# Altium project CSYEI_LayoutExercice2018.PrjPcb
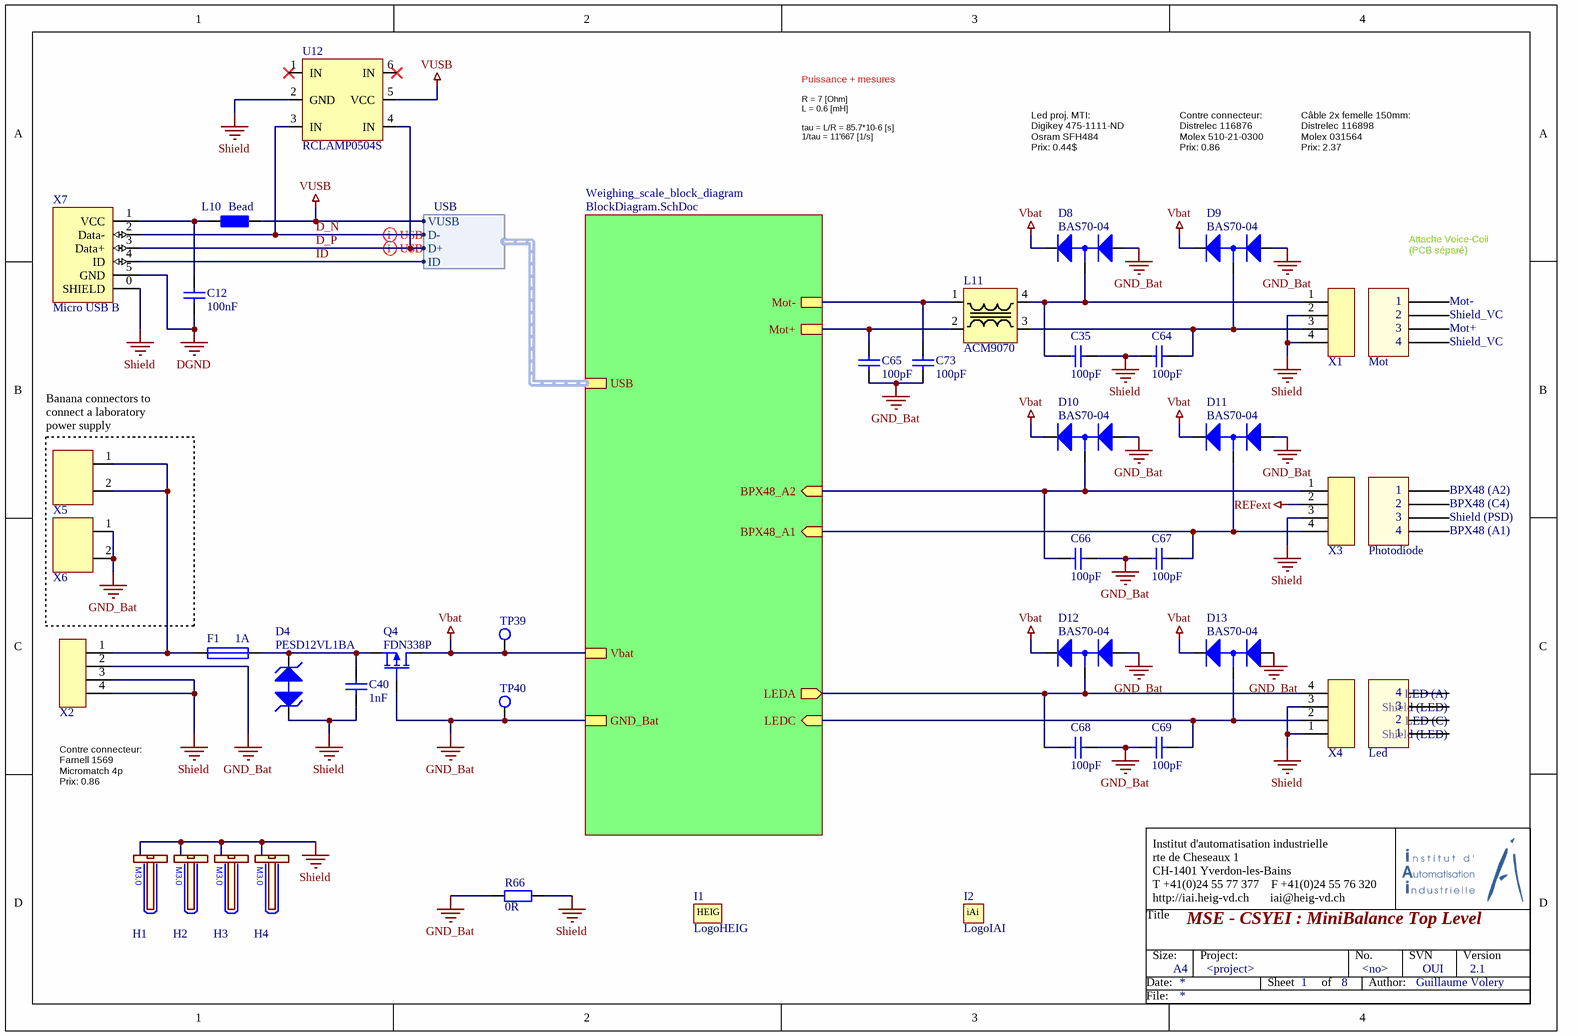
[diagram p0: TopLevel.SchDoc]
8 sheets, 227 parts. Net scope: hierarchical (ports join the sheet entries above them; power ports are global).
Board file: PCB.PcbDoc
Sheets:
  TopLevel.SchDoc
    Weighing_scale_block_diagram = BlockDiagram.SchDoc
      Weighing_scale_controller = Controller.SchDoc
      Weighing_scale_display = Display.SchDoc
      Weighing_scale_power_supply = PowerSupply.SchDoc
      Weighing_scale_position_measurement = PositionMeasurement.SchDoc
      Weighing_scale_current_voltage_measurement = CurrentVoltageMeasurement.SchDoc
      Weighing_scale_capacitive_touch = CapacitiveTouch.SchDoc

## Sheet TopLevel.SchDoc: MSE - CSYEI : MiniBalance Top Level
size A4; Author: Guillaume Volery; SheetNumber: 1; SheetTotal: 8; SVN: OUI; Version: 2.1; NoProject: <no>; TitleProject: <project>; PageSetup: Record=PageOptions|CenterHorizontal=True|CenterVertical=True|PrintScale=0.97|XCorrection=1.00|YCorrection=1.00|PrintKind=0|BorderSize=5000000|LeftOffset=0|BottomOffset=0|Orientation=2|PaperLength=1000|PaperWidth=1000|Scale=100|PaperSource=7|PrintQuality=-3|MediaType=1|DitherType=10|PrintScaleMode=1|PaperKind=A4 (210 x 297 mm)|PaperIndex=9

### Parts
C12  100nF  [CAPC2012N]
C35  100pF  [CAPC2012N]
C40  1nF  [CAPC2012N]
C64  100pF  [CAPC2012N]
C65  100pF  [CAPC2012N]
C66  100pF  [CAPC2012N]
C67  100pF  [CAPC2012N]
C68  100pF  [CAPC2012N]
C69  100pF  [CAPC2012N]
C73  100pF  [CAPC2012N]
D4  PESD12VL1BA  [SOD323]
D8  BAS70-04  [SOT23-3N]
D9  BAS70-04  [SOT23-3N]
D10  BAS70-04  [SOT23-3N]
D11  BAS70-04  [SOT23-3N]
D12  BAS70-04  [SOT23-3N]
D13  BAS70-04  [SOT23-3N]
F1  1A  [RESC2012N]
H1  Mhole M3  [MHOLE_M3.0]  (value not drawn)
H2  Mhole M3  [MHOLE_M3.0]  (value not drawn)
H3  Mhole M3  [MHOLE_M3.0]  (value not drawn)
H4  Mhole M3  [MHOLE_M3.0]  (value not drawn)
I1  LogoHEIG  [LOGO HEIG-VD_TOP/solder TOP]
I2  LogoIAI  [LOGO_IAI_TOP]
L10  Bead  [RESC2012N]
L11  ACM9070  [ACM9070]
Q4  FDN338P  [SOT23-3N]
R66  0R  [RESC2012N]
TP39  TP  [Testpoint]  (value not drawn)
TP40  TP  [Testpoint]  (value not drawn)
U12  RCLAMP0504S  [SOT-23-6]
X1  MicroMatch4p  [MicroMatch4p]  (value not drawn)
X2  MicroMatch4p  [MicroMatch4p]  (value not drawn)
X3  MicroMatch4p  [MicroMatch4p]  (value not drawn)
X4  MicroMatch4p  [MicroMatch4p]  (value not drawn)
X5  Fiche Banane Rouge 4mm  [BANANE]  (value not drawn)
X6  Fiche Banane Noire 4mm  [BANANE]  (value not drawn)
X7  Micro USB B  [Micro_USB_ZX62-B-5PA(33)]

### Sub-sheets
Weighing_scale_block_diagram = BlockDiagram.SchDoc: LEDA (out), LEDC (in), BPX48_A2 (in), BPX48_A1 (in), Mot-, Mot+, Vbat, GND_Bat, USB (harness USB)

### Harnesses
USB: VUSB, D-, D+, ID

### Nets
DGND: C12.1 X7.5(GND)
GND: C69.2 D13.3(A/K) X4.2 ; sheet Weighing_scale_block_diagram/LEDC
GND_Bat: C65.1 C66.2 C67.1 C68.2 C69.1 C73.1 D8.1(A) D9.1(A) D10.1(A) D11.1(A) D12.1(A) D13.1(A) Q4.1(G) R66.1 TP40.1 X2.2 X6.1 X6.2 ; sheet Weighing_scale_block_diagram/GND_Bat
REFext: X3.2
Shield: C35.2 C40.1 C64.1 D4.1(K1) H1.1(S) H2.1(S) H3.1(S) H4.1(S) R66.2 U12.2(GND) X1.2 X1.4 X2.3 X2.4 X3.3 X4.1 X4.3 X7.0(SHIELD)
Vbat: D8.2(K) D9.2(K) D10.2(K) D11.2(K) D12.2(K) D13.2(K) Q4.3(D) TP39.1 ; sheet Weighing_scale_block_diagram/Vbat
VUSB: L10.2 U12.5(VCC) ; sheet Weighing_scale_block_diagram/USB.VUSB
D_N: U12.3(IN) X7.2(Data-) ; sheet Weighing_scale_block_diagram/USB.D-
D_P: U12.4(IN) X7.3(Data+) ; sheet Weighing_scale_block_diagram/USB.D+
ID: X7.4(ID) ; sheet Weighing_scale_block_diagram/USB.ID
Net1_1: C66.1 D10.3(A/K) X3.1 ; sheet Weighing_scale_block_diagram/BPX48_A2
NetC12_2: C12.2 L10.1 X7.1(VCC)
NetC35_1: C35.1 D8.3(A/K) L11.4 X1.1
NetC40_2: C40.2 D4.2(K2) F1.2 Q4.2(S)
NetC64_2: C64.2 D9.3(A/K) L11.3 X1.3
NetC65_2: C65.2 L11.2 ; sheet Weighing_scale_block_diagram/Mot+
NetC67_2: C67.2 D11.3(A/K) X3.4 ; sheet Weighing_scale_block_diagram/BPX48_A1
NetC68_1: C68.1 D12.3(A/K) X4.4 ; sheet Weighing_scale_block_diagram/LEDA
NetC72_1: C73.2 L11.1 ; sheet Weighing_scale_block_diagram/Mot-
NetF1_1: F1.1 X2.1 X5.1 X5.2

Not connected (* = marked no-connect by the designer): U12 1(IN)* 6(IN)*

### Layout directives
differential pair: D_N, D_P

### Notes on the sheet
- Puissance + mesures
- Led proj. MTI:
  Digikey 475-1111-ND
  Osram SFH484
  Prix: 0.44$
- R = 7 [Ohm]
  L = 0.6 [mH]
  tau = L/R = 85.7*10-6 [s]
  1/tau = 11'667 [1/s]
- Contre connecteur:
  Distrelec 116876
  Molex 510-21-0300
  Prix: 0.86
- Câble 2x femelle 150mm:
  Distrelec 116898
  Molex 031564
  Prix: 2.37
- 1
- Attache Voice-Coil
  (PCB séparé)
- Mot-
- (near X1) Mot
- 2
- 3
- 4
- Shield_VC
- Mot+
- (near X5) Banana connectors to connect a laboratory power supply
- BPX48 (A2)
- BPX48 (C4)
- Shield (PSD)
- (near X3) Photodiode
- BPX48 (A1)
- LED (C)
- Shield (LED)
- LED (A)
- (near X4) Led
- Contre connecteur:
  Farnell 1569
  Micromatch 4p
  Prix: 0.86
- Title
- Institut d'automatisation industrielle
  rte de Cheseaux 1
  CH-1401 Yverdon-les-Bains
  T +41(0)24 55 77 377    F +41(0)24 55 76 320
  http://iai.heig-vd.ch       iai@heig-vd.ch
- Date:
- Size:
- A4
- Project:
- Sheet
- of
- No.
- Author:
- SVN
- Version
- File:
- (in symbol LogoHEIG) HEIG
- (in symbol LogoIAI) iAi
- (in symbol M3) M3.0

### Library data of the parts
C12 = Cap_100nF: Capacitor; Value: 100nF; Supplier 1: Digi-Key; Supplier Part Number 1: 478-1395-1-ND
C35 C64-C69 C73 = Cap_100pF: Capacitor; Value: 100pF; Supplier 1: Digi-Key; Supplier Part Number 1: 399-1122-1-ND
C40 = Cap_1nF: Capacitor; Value: 1nF; Supplier 1: Digi-Key; Supplier Part Number 1: 311-1127-1-ND
F1 = Fuse_1A: MFU0805FF01000P100; Supplier 1: Digi-Key; Supplier Part Number 1: MFU08051.00CT-ND; Value: 1A
H1-H4 = M3: Value: Mhole M3
Q4 = FDN338P: MOSFet P; Supplier 1: Digi-Key; Supplier Part Number 1: FDN338PCT-ND; Value: FDN338P
R66 = Res_0R: Resistor; Value: 0R; Supplier 1: Digi-Key; Supplier Part Number 1: 311-0.0ARCT-ND
TP39 TP40 = TP: =Value; Supplier 1: Digi-Key; Supplier Part Number 1: 36-5006-ND
U12 = RCLAMP0504S.TCT: Supplier 1: Digi-Key; Supplier Part Number 1: RCLAMP0504SCT-ND
X7 = Micro_USB_ZX62-B-5PA(33): Supplier 1: Digi-Key; Supplier Part Number 1: H125270CT-ND
D4 = PESD12VL1BA: Supplier 1: Digi-Key; Supplier Part Number 1: 568-4022-1-ND
D8-D13 = BAS70-04: Supplier 1: Digi-Key; Supplier Part Number 1: BAS70-04-FDICT-ND
L10 = Bead: Value: Bead; Supplier 1: Digi-Key; Supplier Part Number 1: 240-2399-1-ND
L11 = ACM9070: Supplier 1: Digi-Key; Supplier Part Number 1: 445-2216-1-ND
X1-X4 = MicroMatch4p: Supplier 1: Digi-Key; Supplier Part Number 1: A107022CT-ND
X5 = Fiche Banane Rouge 4mm: Supplier 1: Farnell; Supplier Part Number 1: 1698982
X6 = Fiche Banane Noire 4mm: Supplier 1: Farnell; Supplier Part Number 1: 1698983

## Sheet BlockDiagram.SchDoc: MSE - CSYEI : Block diagram
size A4; Author: Guillaume Volery; SheetNumber: 2; SheetTotal: 8; SVN: OUI; Version: 2.1; NoProject: <no>; TitleProject: <project>
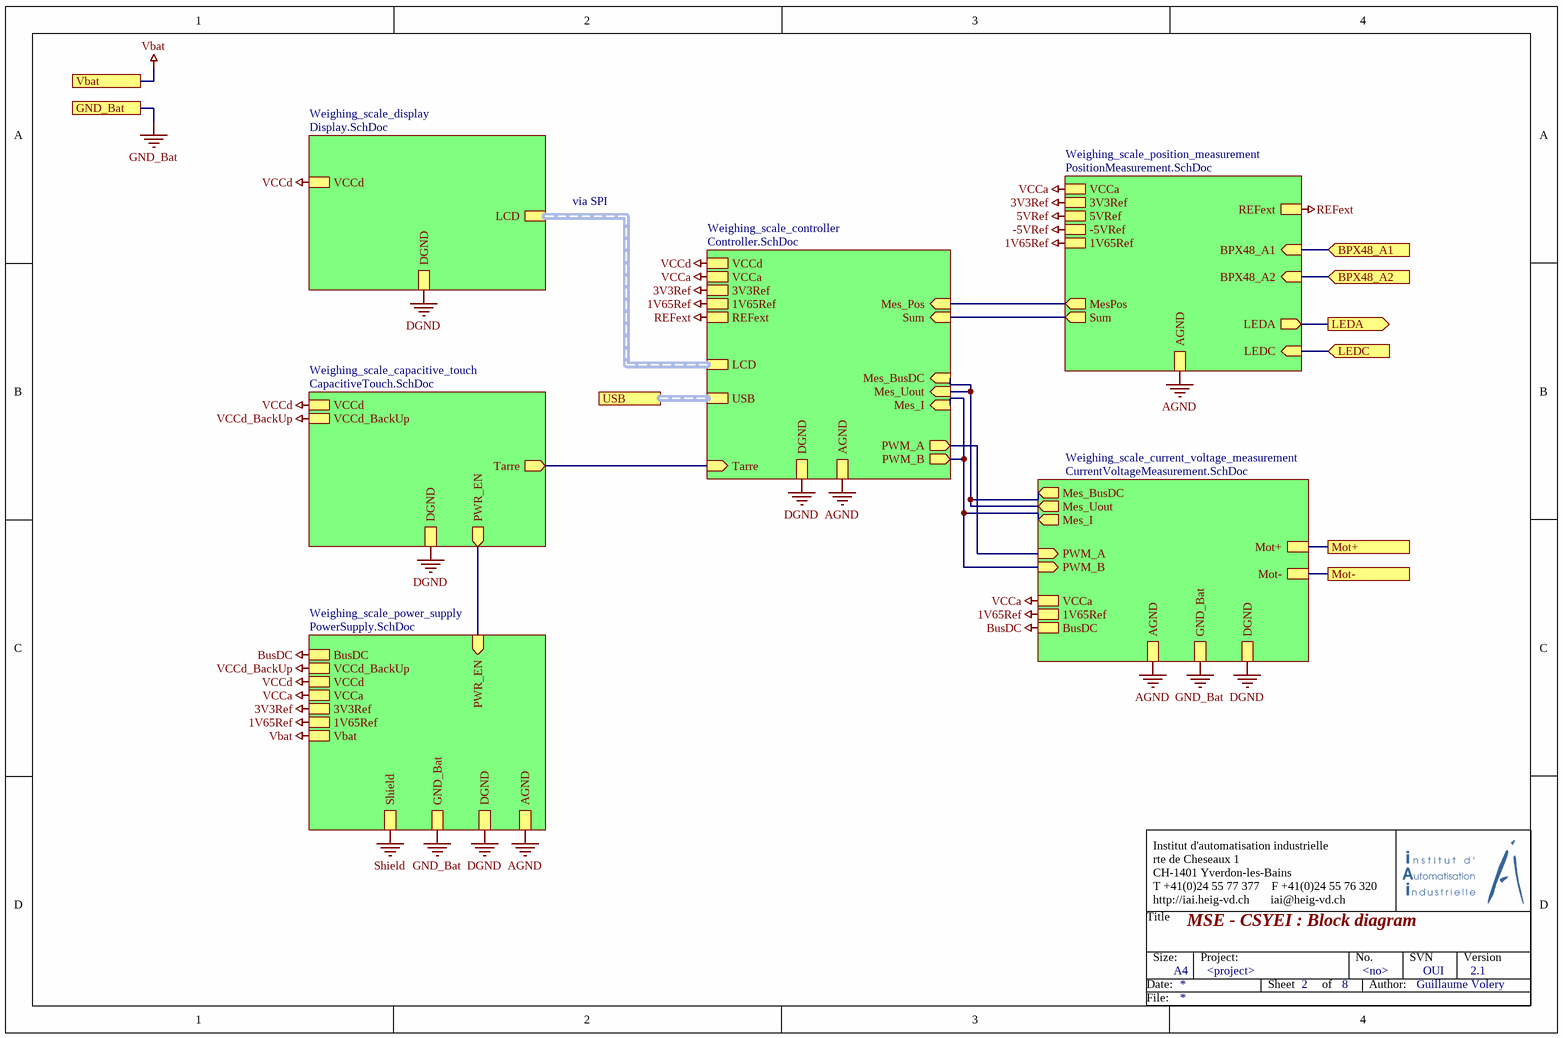
[diagram p1: BlockDiagram.SchDoc]

### Sub-sheets
Weighing_scale_capacitive_touch = CapacitiveTouch.SchDoc: Tarre (out), DGND, PWR_EN (out), VCCd, VCCd_BackUp
Weighing_scale_controller = Controller.SchDoc: VCCd, AGND, Mes_I (in), 3V3Ref, PWM_A (out), Sum (in), PWM_B (out), Mes_Pos (in), DGND, 1V65Ref, Mes_Uout (in), Tarre (in), Mes_BusDC (in), VCCa, LCD (harness LCD), USB (harness USB), REFext
Weighing_scale_current_voltage_measurement = CurrentVoltageMeasurement.SchDoc: Mot+, Mot-, Mes_BusDC (out), Mes_Uout (out), AGND, VCCa, PWM_B (in), GND_Bat, Mes_I (out), DGND, 1V65Ref, BusDC, PWM_A (in)
Weighing_scale_display = Display.SchDoc: VCCd, DGND, LCD (harness LCD)
Weighing_scale_position_measurement = PositionMeasurement.SchDoc: VCCa, MesPos (out), LEDA (out), 3V3Ref, Sum (out), LEDC (in), AGND, REFext, BPX48_A1 (in), BPX48_A2 (in), 5VRef, -5VRef, 1V65Ref
Weighing_scale_power_supply = PowerSupply.SchDoc: Vbat, GND_Bat, AGND, VCCd, BusDC, VCCa, Shield, DGND, PWR_EN (in), VCCd_BackUp, 3V3Ref, 1V65Ref

### Ports
BPX48_A1 (in), BPX48_A2 (in), GND_Bat, LEDA (out), LEDC (in), Mot+, Mot-, USB (harness USB), Vbat

### Nets
1V65Ref: sheet Weighing_scale_controller/1V65Ref, sheet Weighing_scale_power_supply/1V65Ref, sheet Weighing_scale_position_measurement/1V65Ref, sheet Weighing_scale_current_voltage_measurement/1V65Ref
3V3Ref: sheet Weighing_scale_controller/3V3Ref, sheet Weighing_scale_power_supply/3V3Ref, sheet Weighing_scale_position_measurement/3V3Ref
-5VRef: sheet Weighing_scale_position_measurement/-5VRef
AGND: sheet Weighing_scale_controller/AGND, sheet Weighing_scale_power_supply/AGND, sheet Weighing_scale_position_measurement/AGND, sheet Weighing_scale_current_voltage_measurement/AGND
BusDC: sheet Weighing_scale_power_supply/BusDC, sheet Weighing_scale_current_voltage_measurement/BusDC
DGND: sheet Weighing_scale_controller/DGND, sheet Weighing_scale_display/DGND, sheet Weighing_scale_power_supply/DGND, sheet Weighing_scale_current_voltage_measurement/DGND, sheet Weighing_scale_capacitive_touch/DGND
GND: port LEDC, sheet Weighing_scale_position_measurement/LEDC
GND_Bat: port GND_Bat, sheet Weighing_scale_power_supply/GND_Bat, sheet Weighing_scale_current_voltage_measurement/GND_Bat
REFext: sheet Weighing_scale_controller/REFext, sheet Weighing_scale_position_measurement/REFext
Vbat: port Vbat, sheet Weighing_scale_power_supply/Vbat
VCCa: sheet Weighing_scale_controller/VCCa, sheet Weighing_scale_power_supply/VCCa, sheet Weighing_scale_position_measurement/VCCa, sheet Weighing_scale_current_voltage_measurement/VCCa
VCCd: sheet Weighing_scale_controller/VCCd, sheet Weighing_scale_display/VCCd, sheet Weighing_scale_power_supply/VCCd, sheet Weighing_scale_capacitive_touch/VCCd
VCCd_BackUp: sheet Weighing_scale_power_supply/VCCd_BackUp, sheet Weighing_scale_capacitive_touch/VCCd_BackUp
PWM_A: sheet Weighing_scale_controller/PWM_A, sheet Weighing_scale_current_voltage_measurement/PWM_A
PWM_B: sheet Weighing_scale_controller/Mes_I, sheet Weighing_scale_controller/PWM_B, sheet Weighing_scale_current_voltage_measurement/PWM_B, sheet Weighing_scale_current_voltage_measurement/Mes_I
PWR_EN: sheet Weighing_scale_power_supply/PWR_EN, sheet Weighing_scale_capacitive_touch/PWR_EN
Tarre: sheet Weighing_scale_controller/Tarre, sheet Weighing_scale_capacitive_touch/Tarre
Net1_1: port BPX48_A2, sheet Weighing_scale_position_measurement/BPX48_A2
NetC15_1: sheet Weighing_scale_controller/Mes_Uout, sheet Weighing_scale_controller/Mes_BusDC, sheet Weighing_scale_current_voltage_measurement/Mes_BusDC, sheet Weighing_scale_current_voltage_measurement/Mes_Uout
NetC65_2: port Mot+, sheet Weighing_scale_current_voltage_measurement/Mot+
NetC67_2: port BPX48_A1, sheet Weighing_scale_position_measurement/BPX48_A1
NetC68_1: port LEDA, sheet Weighing_scale_position_measurement/LEDA
NetC72_1: port Mot-, sheet Weighing_scale_current_voltage_measurement/Mot-
NetIC_OPAMP_GP_1_CIRCUIT_8DII#2_OUTPUT: sheet Weighing_scale_controller/Mes_Pos, sheet Weighing_scale_position_measurement/MesPos
NetIC_OPAMP_GP_1_CIRCUIT_8DII#4_OUTPUT: sheet Weighing_scale_controller/Sum, sheet Weighing_scale_position_measurement/Sum

### Buses and harness runs
harness port USB = sheet Weighing_scale_controller/USB
harness sheet Weighing_scale_controller/LCD = sheet Weighing_scale_display/LCD

### Notes on the sheet
- via SPI
- Title
- Institut d'automatisation industrielle
  rte de Cheseaux 1
  CH-1401 Yverdon-les-Bains
  T +41(0)24 55 77 377    F +41(0)24 55 76 320
  http://iai.heig-vd.ch       iai@heig-vd.ch
- Date:
- Size:
- A4
- Project:
- Sheet
- of
- No.
- Author:
- SVN
- Version
- File:

## Sheet Controller.SchDoc: MSE - CSYEI : DSPic controller
size A3; Author: Guillaume Volery; SheetNumber: 4; SheetTotal: 8; SVN: OUI; Version: 2.1; NoProject: <no>; TitleProject: <project>; PageSetup: Record=PageOptions|CenterHorizontal=True|CenterVertical=True|PrintScale=1.00|XCorrection=1.00|YCorrection=1.00|PrintKind=0|BorderSize=5000000|LeftOffset=0|BottomOffset=0|Orientation=2|PaperLength=1000|PaperWidth=1000|Scale=100|PaperSource=7|PrintQuality=-3|MediaType=1|DitherType=10|PrintScaleMode=1|PaperKind=A4 (210 x 297 mm)|PaperIndex=9
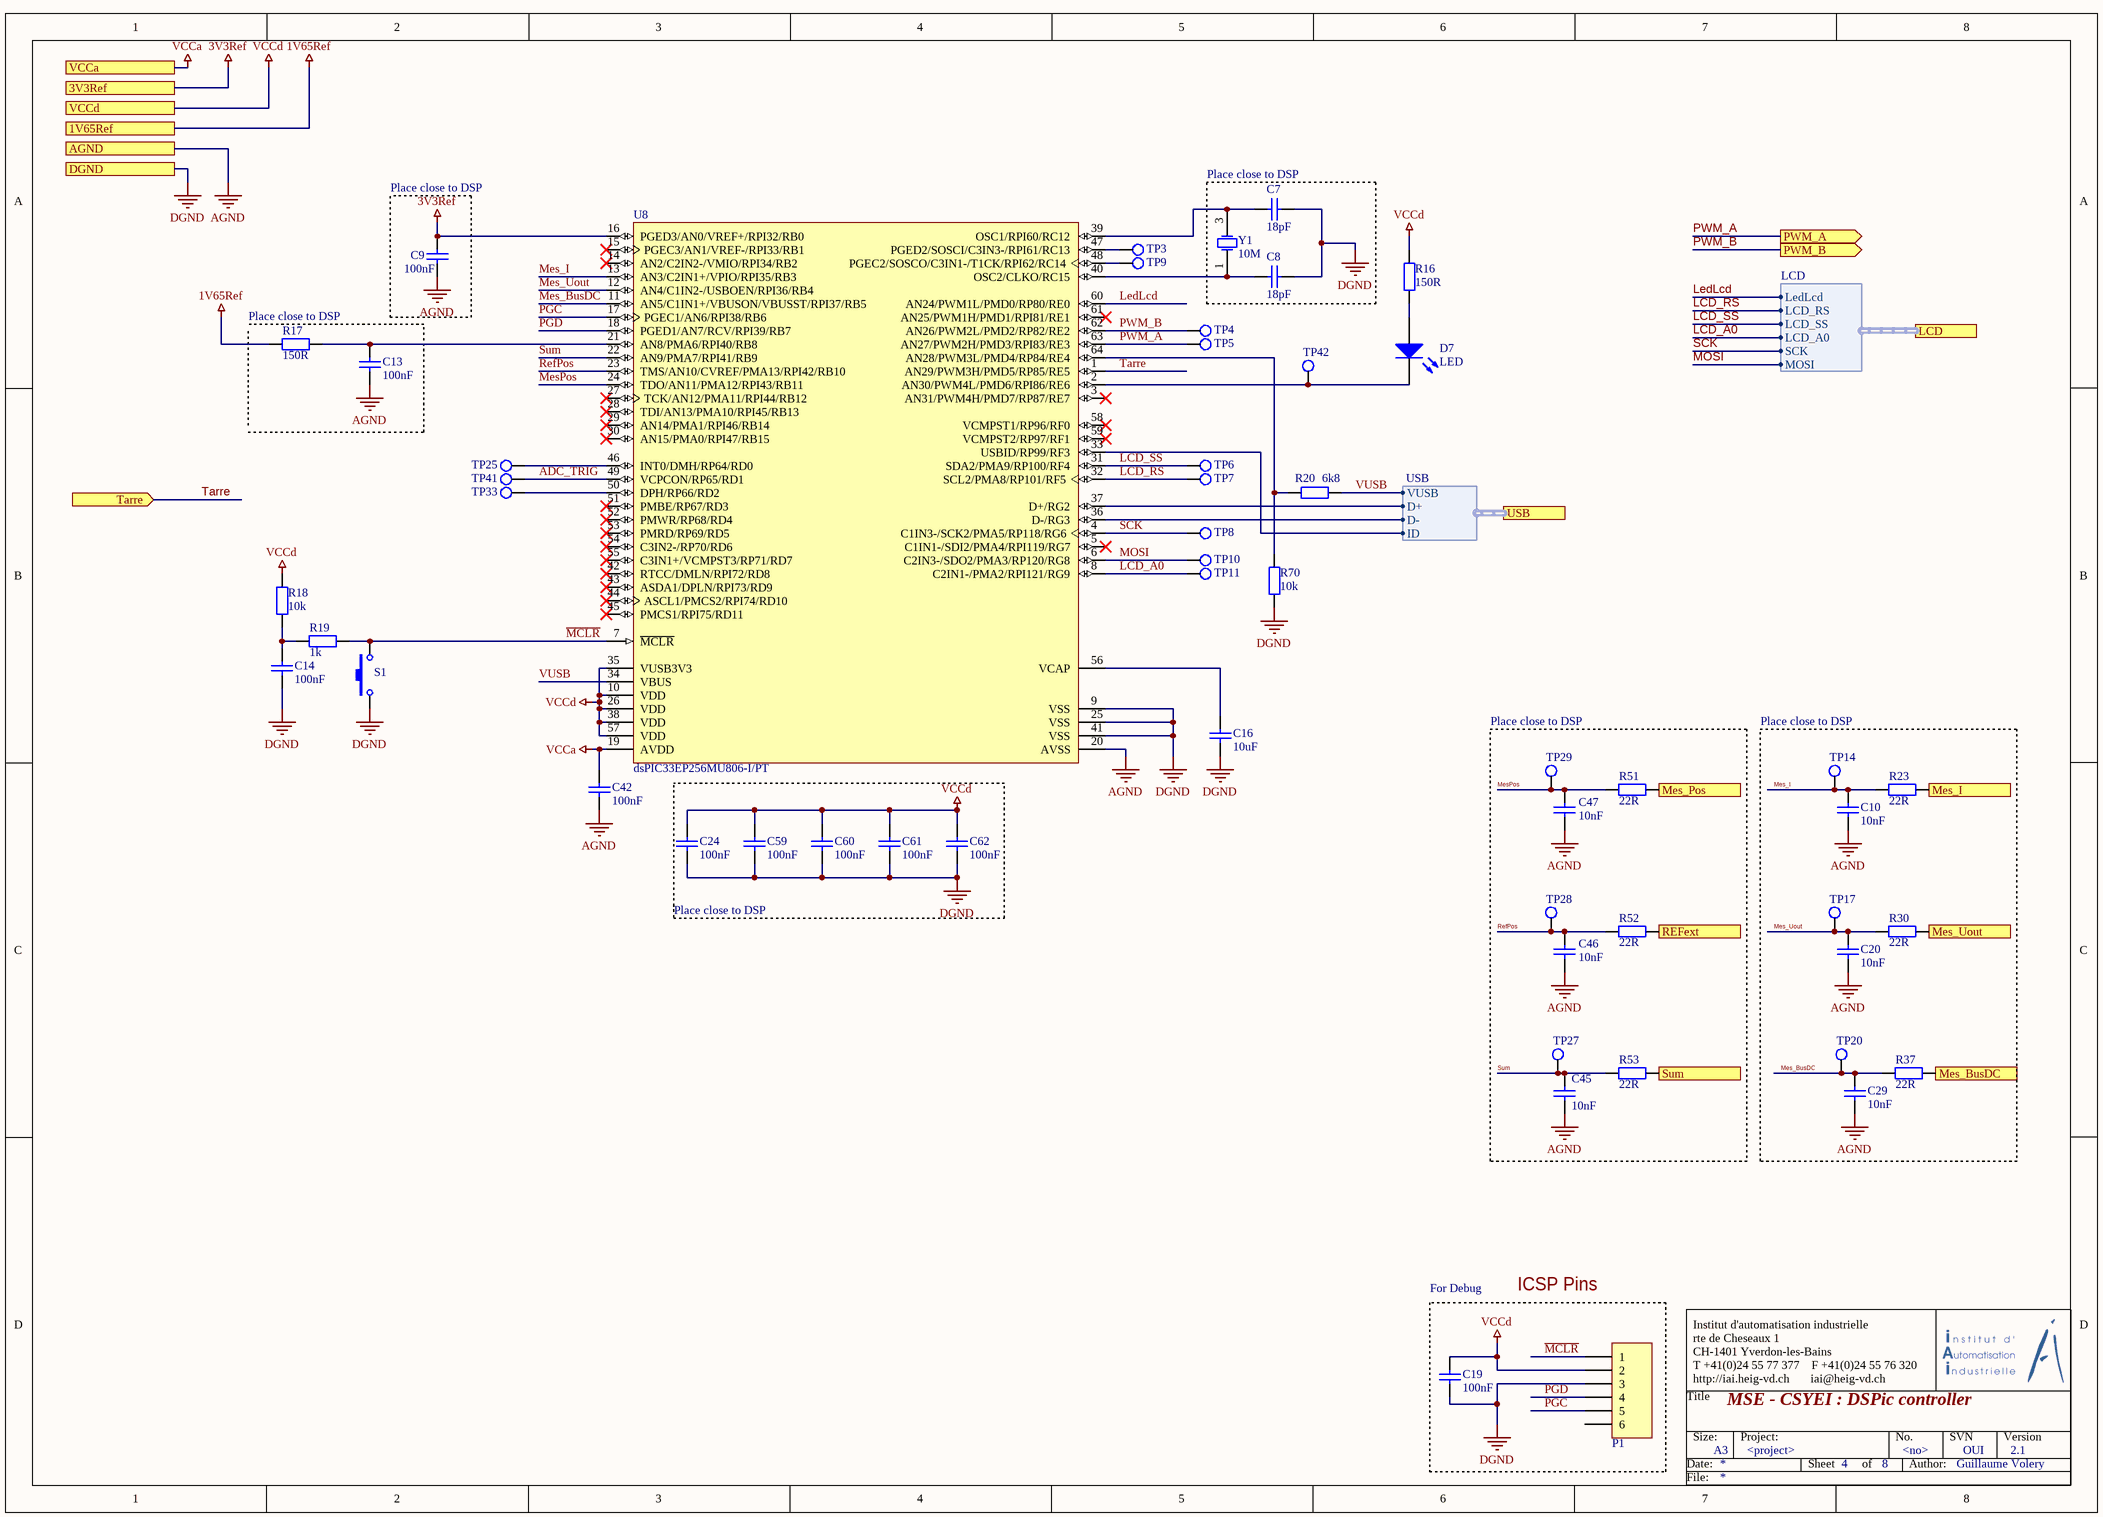
[diagram p2: Controller.SchDoc]

### Parts
C7  18pF  [CAPC2012N]
C8  18pF  [CAPC2012N]
C9  100nF  [CAPC2012N]
C10  10nF  [CAPC2012N]
C13  100nF  [CAPC2012N]
C14  100nF  [CAPC2012N]
C16  10uF  [CAP1206]
C19  100nF  [CAPC2012N]
C20  10nF  [CAPC2012N]
C24  100nF  [CAPC2012N]
C29  10nF  [CAPC2012N]
C42  100nF  [CAPC2012N]
C45  10nF  [CAPC2012N]
C46  10nF  [CAPC2012N]
C47  10nF  [CAPC2012N]
C59  100nF  [CAPC2012N]
C60  100nF  [CAPC2012N]
C61  100nF  [CAPC2012N]
C62  100nF  [CAPC2012N]
D7  LED  [LED2012N]
P1  Connector  [HEADER_6]  (value not drawn)
R16  150R  [RESC2012N]
R17  150R  [RESC2012N]
R18  10k  [RESC2012N]
R19  1k  [RESC2012N]
R20  6k8  [RESC2012N]
R23  22R  [RESC2012N]
R30  22R  [RESC2012N]
R37  22R  [RESC2012N]
R51  22R  [RESC2012N]
R52  22R  [RESC2012N]
R53  22R  [RESC2012N]
R70  10k  [RESC2012N]
S1  SW PTS810  [SW PTS810]  (value not drawn)
TP3  TP  [Testpoint]  (value not drawn)
TP4  TP  [Testpoint]  (value not drawn)
TP5  TP  [Testpoint]  (value not drawn)
TP6  TP  [Testpoint]  (value not drawn)
TP7  TP  [Testpoint]  (value not drawn)
TP8  TP  [Testpoint]  (value not drawn)
TP9  TP  [Testpoint]  (value not drawn)
TP10  TP  [Testpoint]  (value not drawn)
TP11  TP  [Testpoint]  (value not drawn)
TP14  TP  [Testpoint]  (value not drawn)
TP17  TP  [Testpoint]  (value not drawn)
TP20  TP  [Testpoint]  (value not drawn)
TP25  TP  [Testpoint]  (value not drawn)
TP27  TP  [Testpoint]  (value not drawn)
TP28  TP  [Testpoint]  (value not drawn)
TP29  TP  [Testpoint]  (value not drawn)
TP33  TP  [Testpoint]  (value not drawn)
TP41  TP  [Testpoint]  (value not drawn)
TP42  TP  [Testpoint]  (value not drawn)
U8  dsPIC33EP256MU806-I/PT  [TQFP64]
Y1  value 10M  [CRYSTAL_ABMM]  (hidden comment: XTAL)

### Blocks framed on the sheet
Place close to DSP: C7 C8 Y1
Place close to DSP: C9
Place close to DSP: C45-C47 R51-R53 TP27-TP29
Place close to DSP: C10 C20 C29 R23 R30 R37 TP14 TP17 TP20
ICSP Pins: C19 P1

### Ports
1V65Ref, 3V3Ref, AGND, DGND, LCD (harness LCD), Mes_BusDC (in), Mes_I (in), Mes_Pos (in), Mes_Uout (in), PWM_A (out), PWM_B (out), REFext, Sum (in), Tarre (in), USB (harness USB), VCCa, VCCd

### Harnesses
LCD: LCD_RS, LCD_SS, MOSI, SCK, LedLcd, LCD_A0
USB: VUSB, D-, D+, ID

### Nets
1V65Ref: R17.1 ; port 1V65Ref
3V3Ref: C9.2 U8.16(PGED3/AN0/VREF+/RPI32/RB0) ; port 3V3Ref
AGND: C9.1 C10.1 C13.1 C20.1 C29.1 C42.1 C45.1 C46.1 C47.1 U8.20(AVSS) ; port AGND
DGND: C7.2 C8.2 C14.1 C16.1 C19.1 C24.1 C59.1 C60.1 C61.1 C62.1 P1.3 R70.1 S1.1 U8.9(VSS) U8.25(VSS) U8.41(VSS) ; port DGND
REFext: R52.2 ; port REFext
VCCa: C42.2 U8.19(AVDD) ; port VCCa
VCCd: C19.2 C24.2 C59.2 C60.2 C61.2 C62.2 P1.2 R16.2 R18.2 U8.10(VDD) U8.26(VDD) U8.35(VUSB3V3) U8.38(VDD) U8.57(VDD) ; port VCCd
VUSB: R20.2 U8.34(VBUS) ; port USB.VUSB
~{MCLR}: P1.1 R19.2 S1.3 U8.7(~{MCLR})
ADC_TRIG: TP41.1 U8.49(VCPCON/RP65/RD1)
D_N: U8.36(D-/RG3) ; port USB.D-
D_P: U8.37(D+/RG2) ; port USB.D+
ID: U8.33(USBID/RP99/RF3) ; port USB.ID
LCD_A0: TP11.1 U8.8(C2IN1-/PMA2/RPI121/RG9) ; port LCD.LCD_A0
LCD_RS: TP7.1 U8.32(SCL2/PMA8/RP101/RF5) ; port LCD.LCD_RS
LCD_SS: TP6.1 U8.31(SDA2/PMA9/RP100/RF4) ; port LCD.LCD_SS
LedLcd: U8.60(AN24/PWM1L/PMD0/RP80/RE0) ; port LCD.LedLcd
Mes_BusDC: C29.2 R37.1 TP20.1 U8.11(AN5/C1IN1+/VBUSON/VBUSST/RPI37/RB5)
Mes_I: C10.2 R23.1 TP14.1 U8.13(AN3/C2IN1+/VPIO/RPI35/RB3)
Mes_Uout: C20.2 R30.1 TP17.1 U8.12(AN4/C1IN2-/USBOEN/RPI36/RB4)
MesPos: C47.2 R51.1 TP29.1 U8.24(TDO/AN11/PMA12/RPI43/RB11)
MOSI: TP10.1 U8.6(C2IN3-/SDO2/PMA3/RP120/RG8) ; port LCD.MOSI
PGC: P1.5 U8.17(PGEC1/AN6/RPI38/RB6)
PGD: P1.4 U8.18(PGED1/AN7/RCV/RPI39/RB7)
PWM_A: TP5.1 U8.63(AN27/PWM2H/PMD3/RPI83/RE3) ; port PWM_A
PWM_B: R23.2 TP4.1 U8.62(AN26/PWM2L/PMD2/RP82/RE2) ; port PWM_B, port Mes_I
RefPos: C46.2 R52.1 TP28.1 U8.23(TMS/AN10/CVREF/PMA13/RPI42/RB10)
SCK: TP8.1 U8.4(C1IN3-/SCK2/PMA5/RP118/RG6) ; port LCD.SCK
Sum: C45.2 R53.1 TP27.1 U8.22(AN9/PMA7/RPI41/RB9)
Tarre: U8.1(AN29/PWM3H/PMD5/RP85/RE5) ; port Tarre
NetC7_1: C7.1 U8.39(OSC1/RPI60/RC12) Y1.3(OSC2)
NetC8_1: C8.1 U8.40(OSC2/CLKO/RC15) Y1.1(OSC1)
NetC13_2: C13.2 R17.2 U8.21(AN8/PMA6/RPI40/RB8)
NetC14_2: C14.2 R18.1 R19.1
NetC15_1: R30.2 R37.2 ; port Mes_Uout, port Mes_BusDC
NetC16_2: C16.2 U8.56(VCAP)
NetD7_1: D7.1(A) R16.1
NetD7_2: D7.2(K) TP42.1 U8.2(AN30/PWM4L/PMD6/RPI86/RE6)
NetIC_OPAMP_GP_1_CIRCUIT_8DII#2_OUTPUT: R51.2 ; port Mes_Pos
NetIC_OPAMP_GP_1_CIRCUIT_8DII#4_OUTPUT: R53.2 ; port Sum
NetR20_1: R20.1 R70.2 U8.64(AN28/PWM3L/PMD4/RP84/RE4)
NetTP3_1: TP3.1 U8.47(PGED2/SOSCI/C3IN3-/RPI61/RC13)
NetTP9_1: TP9.1 U8.48(PGEC2/SOSCO/C3IN1-/T1CK/RPI62/RC14)
NetTP25_1: TP25.1 U8.46(INT0/DMH/RP64/RD0)
NetTP33_1: TP33.1 U8.50(DPH/RP66/RD2)

Not connected (* = marked no-connect by the designer): P1 6; U8 3(AN31/PWM4H/PMD7/RP87/RE7)* 5(C1IN1-/SDI2/PMA4/RPI119/RG7)* 14(AN2/C2IN2-/VMIO/RPI34/RB2)* 15(PGEC3/AN1/VREF-/RPI33/RB1)* 27(TCK/AN12/PMA11/RPI44/RB12)* 28(TDI/AN13/PMA10/RPI45/RB13)* 29(AN14/PMA1/RPI46/RB14)* 30(AN15/PMA0/RPI47/RB15)* 42(RTCC/DMLN/RPI72/RD8)* 43(ASDA1/DPLN/RPI73/RD9)* 44(ASCL1/PMCS2/RPI74/RD10)* 45(PMCS1/RPI75/RD11)* 51(PMBE/RP67/RD3)* 52(PMWR/RP68/RD4)* 53(PMRD/RP69/RD5)* 54(C3IN2-/RP70/RD6)* 55(C3IN1+/VCMPST3/RP71/RD7)* 58(VCMPST1/RP96/RF0)* 59(VCMPST2/RP97/RF1)* 61(AN25/PWM1H/PMD1/RPI81/RE1)*

### Notes on the sheet
- (near R17) Place close to DSP
- Place close to DSP
- For Debug
- Title
- Institut d'automatisation industrielle
  rte de Cheseaux 1
  CH-1401 Yverdon-les-Bains
  T +41(0)24 55 77 377    F +41(0)24 55 76 320
  http://iai.heig-vd.ch       iai@heig-vd.ch
- Date:
- Size:
- A3
- Project:
- Sheet
- of
- No.
- Author:
- SVN
- Version
- File:

### Library data of the parts
C7 C8 = Cap_18pF: Capacitor; Value: 18pF; Supplier 1: Digi-Key; Supplier Part Number 1: 311-1102-1-ND
C9 C13 C14 C19 C24 C42 C59-C62 = Cap_100nF: Capacitor; Value: 100nF; Supplier 1: Digi-Key; Supplier Part Number 1: 478-1395-1-ND
C10 C20 C29 C45-C47 = Cap_10nF: Capacitor; Value: 10nF; Supplier 1: Digi-Key; Supplier Part Number 1: 311-1136-1-ND
C16 = Cap_10uF: Capacitor; Value: 10uF; Supplier 1: Digi-Key; Supplier Part Number 1: 445-7886-1-ND
D7 = Led_Rouge_0805: Supplier 1: Digi-Key; Supplier Part Number 1: 475-1415-1-ND
P1 = Header 6: Header, 6-Pin; Supplier Part Number 1: S9015E-03-ND; Supplier 1: Digi-Key
R16 R17 = Res_150R: Resistor; Value: 150R; Supplier 1: Digi-Key; Supplier Part Number 1: 311-150CRCT-ND
R18 R70 = Res_10k: Resistor; Value: 10k; Supplier 1: Digi-Key; Supplier Part Number 1: 311-10.0KCRCT-ND
R19 = Res__1k: Resistor; Value: 1k; Supplier 1: Digi-Key; Supplier Part Number 1: 311-1.00KCRCT-ND
R20 = Res_6k8: Resistor; Value: 6k8; Supplier 1: Digi-Key; Supplier Part Number 1: 311-6.80KCRCT-ND
R23 R30 R37 R51-R53 = Res_22R: Resistor; Value: 22R; Supplier 1: Digi-Key; Supplier Part Number 1: 311-22.0CRCT-ND
S1 = SW PTS810: Switch; Supplier 1: Digi-Key; Supplier Part Number 1: CKN10502CT-ND
TP3-TP11 TP14 TP17 TP20 TP25 TP27-TP29 TP33 TP41 TP42 = TP: =Value; Supplier 1: Digi-Key; Supplier Part Number 1: 36-5006-ND
U8 = dsPIC33EP256MU806-I/PT: 16-Bit Digital Signal Processor; Supplier 1: Digi-Key; Supplier Part Number 1: DSPIC33EP256MU806-I/PT-ND; Value: DSPIC33EP256MU806-I/PT
Y1 = XTAL: Crystal Oscillator; Supplier 1: Digi-Key; Supplier Part Number 1: 535-9150-1-ND

## Sheet Display.SchDoc: MSE - CSYEI : Dot matrix display
size A4; Author: Guillaume Volery; SheetNumber: 5; SheetTotal: 8; SVN: OUI; Version: 2.1; NoProject: <no>; TitleProject: <project>; PageSetup: Record=PageOptions|CenterHorizontal=True|CenterVertical=True|PrintScale=0.97|XCorrection=1.00|YCorrection=1.00|PrintKind=0|BorderSize=5000000|LeftOffset=0|BottomOffset=0|Orientation=2|PaperLength=1000|PaperWidth=1000|Scale=100|PaperSource=7|PrintQuality=-3|MediaType=1|DitherType=10|PrintScaleMode=1|PaperKind=A4 (210 x 297 mm)|PaperIndex=9
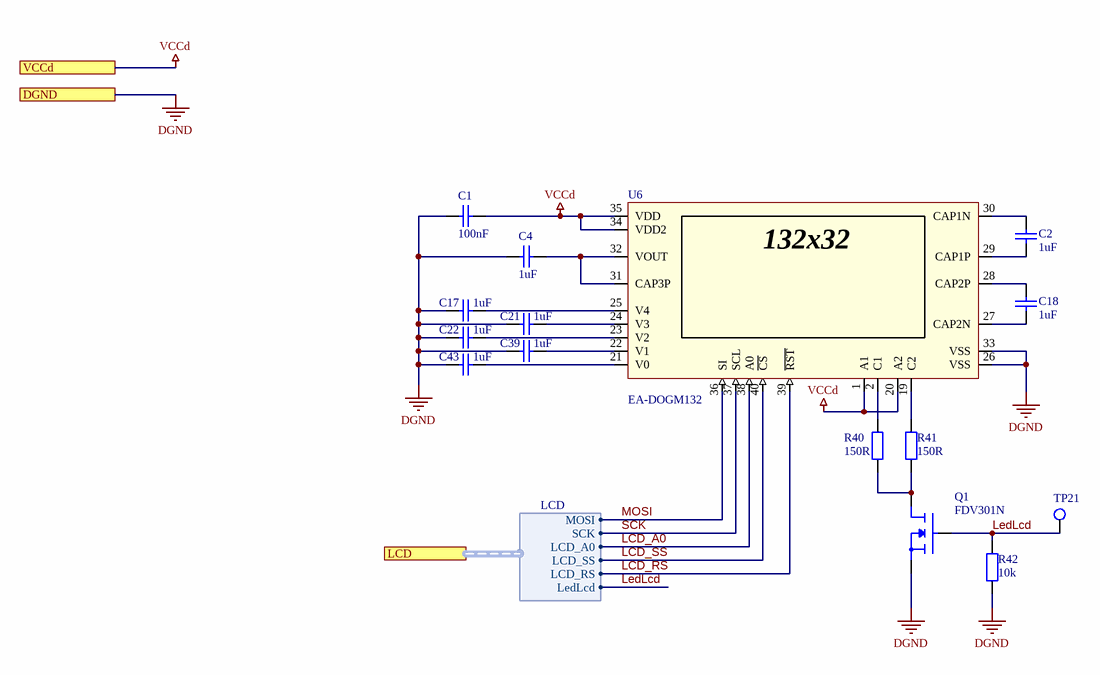
[diagram p3: Display.SchDoc]

### Parts
C1  100nF  [CAPC2012N]
C2  1uF  [CAPC2012N]
C4  1uF  [CAPC2012N]
C17  1uF  [CAPC2012N]
C18  1uF  [CAPC2012N]
C21  1uF  [CAPC2012N]
C22  1uF  [CAPC2012N]
C39  1uF  [CAPC2012N]
C43  1uF  [CAPC2012N]
Q1  FDV301N  [SOT23-3N]
R40  150R  [RESC2012N]
R41  150R  [RESC2012N]
R42  10k  [RESC2012N]
TP21  TP  [Testpoint]  (value not drawn)
U6  EA-DOGM132  [EA_DOGM132_WITH_BACKLIGHT]

### Ports
DGND, LCD (harness LCD), VCCd

### Harnesses
LCD: LCD_RS, LCD_SS, MOSI, SCK, LedLcd, LCD_A0

### Nets
DGND: C1.1 C4.1 C17.1 C21.1 C22.1 C39.1 C43.1 Q1.2(S) R42.1 U6.26(VSS) U6.33(VSS) ; port DGND
VCCd: C1.2 U6.1(A1) U6.20(A2) U6.34(VDD2) U6.35(VDD) ; port VCCd
LCD_A0: U6.38(A0) ; port LCD.LCD_A0
LCD_RS: U6.39(~{RST}) ; port LCD.LCD_RS
LCD_SS: U6.40(~{CS}) ; port LCD.LCD_SS
LedLcd: Q1.1(G) R42.2 TP21.1 ; port LCD.LedLcd
MOSI: U6.36(SI) ; port LCD.MOSI
SCK: U6.37(SCL) ; port LCD.SCK
NetC2_1: C2.1 U6.29(CAP1P)
NetC2_2: C2.2 U6.30(CAP1N)
NetC4_2: C4.2 U6.31(CAP3P) U6.32(VOUT)
NetC17_2: C17.2 U6.25(V4)
NetC18_1: C18.1 U6.27(CAP2N)
NetC18_2: C18.2 U6.28(CAP2P)
NetC21_2: C21.2 U6.24(V3)
NetC22_2: C22.2 U6.23(V2)
NetC39_2: C39.2 U6.22(V1)
NetC43_2: C43.2 U6.21(V0)
NetQ1_3: Q1.3(D) R40.1 R41.1
NetR40_2: R40.2 U6.2(C1)
NetR41_2: R41.2 U6.19(C2)

### Notes on the sheet
- Title
- Institut d'automatisation industrielle
  rte de Cheseaux 1
  CH-1401 Yverdon-les-Bains
  T +41(0)24 55 77 377    F +41(0)24 55 76 320
  http://iai.heig-vd.ch       iai@heig-vd.ch
- Date:
- Size:
- A4
- Project:
- Sheet
- of
- No.
- Author:
- SVN
- Version
- File:
- (in symbol DOGM_132-5) 132x32

### Library data of the parts
C1 = Cap_100nF: Capacitor; Value: 100nF; Supplier 1: Digi-Key; Supplier Part Number 1: 478-1395-1-ND
C2 C4 C17 C18 C21 C22 C39 C43 = Cap_1uF: Capacitor; Value: 1uF; Supplier 1: Digi-Key; Supplier Part Number 1: 490-10743-1-ND
R40 R41 = Res_150R: Resistor; Value: 150R; Supplier 1: Digi-Key; Supplier Part Number 1: 311-150CRCT-ND
R42 = Res_10k: Resistor; Value: 10k; Supplier 1: Digi-Key; Supplier Part Number 1: 311-10.0KCRCT-ND
TP21 = TP: =Value; Supplier 1: Digi-Key; Supplier Part Number 1: 36-5006-ND
U6 = DOGM_132-5: Chip On Glass Graphic LCD; Value: EA-DOGM132
Q1 = FDV301N: Value: FDV301N; Supplier 1: Digi-Key; Supplier Part Number 1: FDV301NCT-ND

## Sheet PowerSupply.SchDoc: MSE - CSYEI : Power supply
size A4; Author: Guillaume Volery; SheetNumber: 3; SheetTotal: 8; SVN: OUI; Version: 2.1; NoProject: <no>; TitleProject: <project>
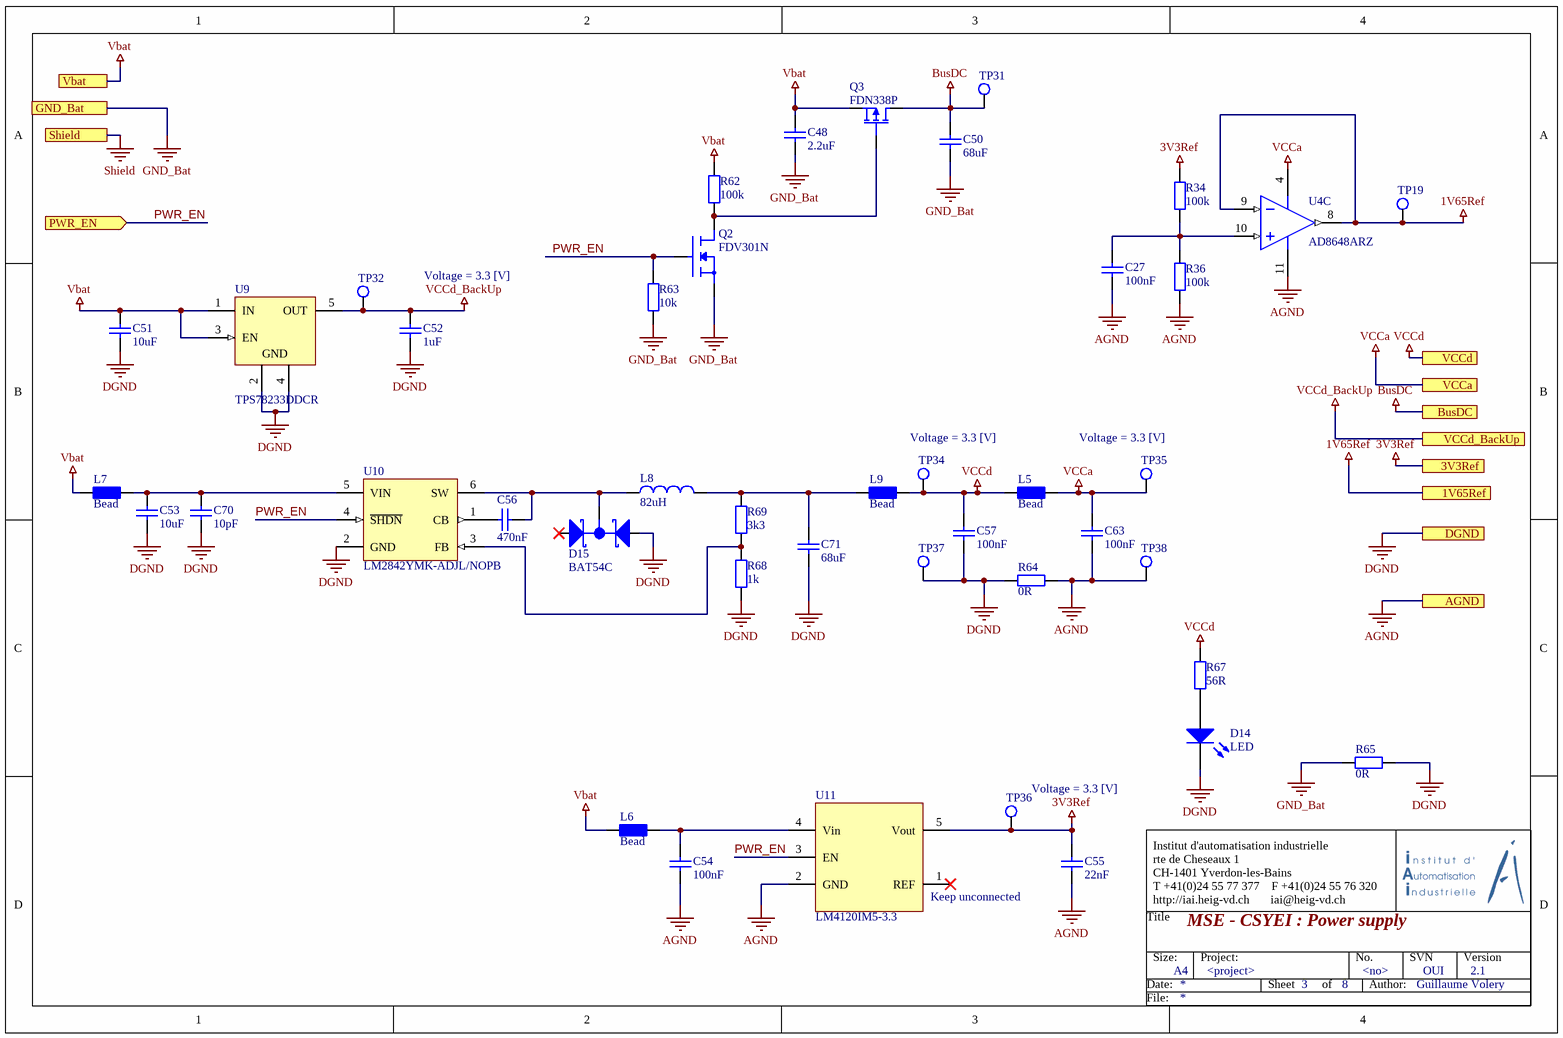
[diagram p4: PowerSupply.SchDoc]

### Parts
C27  100nF  [CAPC2012N]
C48  2.2uF  [CAPC2012N]
C50  68uF  [CAP1206]
C51  10uF  [CAP1206]
C52  1uF  [CAPC2012N]
C53  10uF  [CAP1206]
C54  100nF  [CAPC2012N]
C55  22nF  [CAPC2012N]
C56  470nF  [CAPC2012N]
C57  100nF  [CAPC2012N]
C63  100nF  [CAPC2012N]
C70  10pF  [CAPC2012N]
C71  68uF  [CAP1206]
D14  LED  [LED2012N]
D15  BAT54C  [SOT23-3N]
L5  Bead  [RESC2012N]
L6  Bead  [RESC2012N]
L7  Bead  [RESC2012N]
L8  82uH  [SRR1260A-820MC]
L9  Bead  [RESC2012N]
Q2  FDV301N  [SOT23-3N]
Q3  FDN338P  [SOT23-3N]
R34  100k  [RESC2012N]
R36  100k  [RESC2012N]
R62  100k  [RESC2012N]
R63  10k  [RESC2012N]
R64  0R  [RESC2012N]
R65  0R  [RESC2012N]
R67  56R  [RESC2012N]
R68  1k  [RESC2012N]
R69  3k3  [RESC2012N]
TP19  TP  [Testpoint]  (value not drawn)
TP31  TP  [Testpoint]  (value not drawn)
TP32  TP  [Testpoint]  (value not drawn)
TP34  TP  [Testpoint]  (value not drawn)
TP35  TP  [Testpoint]  (value not drawn)
TP36  TP  [Testpoint]  (value not drawn)
TP37  TP  [Testpoint]  (value not drawn)
TP38  TP  [Testpoint]  (value not drawn)
U4  AD8648ARZ  [ADI-R-14_M]  (part C of 4)
U9  TPS78233DDCR  [SOT-23-5]
U10  LM2842YMK-ADJL/NOPB  [SOT-23-6]
U11  LM4120IM5-3.3  [SOT-23-5]

### Ports
1V65Ref, 3V3Ref, AGND, BusDC, DGND, GND_Bat, PWR_EN (in), Shield, Vbat, VCCa, VCCd, VCCd_BackUp

### Nets
1V65Ref: TP19.1 U4.8(OUT_C) U4.9(-IN_C) ; port 1V65Ref
3V3Ref: C55.2 R34.2 TP36.1 U11.5(Vout) ; port 3V3Ref
AGND: C27.1 C54.1 C55.1 C63.1 R36.1 R64.2 TP38.1 U4.11(-V) U11.2(GND) ; port AGND
BusDC: C50.2 Q3.3(D) TP31.1 ; port BusDC
DGND: C51.1 C52.1 C53.1 C57.1 C70.1 C71.1 D14.2(K) D15.2(A2) R64.1 R65.2 R68.2 TP37.1 U9.2(GND) U9.4(GND) U10.2(GND) ; port DGND
GND_Bat: C48.1 C50.1 Q2.2(S) R63.1 R65.1 ; port GND_Bat
Vbat: C48.2 C51.2 L6.1 L7.1 Q3.2(S) R62.2 U9.1(IN) U9.3(EN) ; port Vbat
VCCa: C63.2 L5.2 TP35.1 U4.4(+V) ; port VCCa
VCCd: C57.2 L5.1 L9.2 R67.2 TP34.1 ; port VCCd
VCCd_BackUp: C52.2 TP32.1 U9.5(OUT) ; port VCCd_BackUp
PWR_EN: Q2.1(G) R63.2 U10.4(~{SHDN}) U11.3(EN) ; port PWR_EN
NetC27_2: C27.2 R34.1 R36.2 U4.10(+IN_C)
NetC53_2: C53.2 C70.2 L7.2 U10.5(VIN)
NetC54_2: C54.2 L6.2 U11.4(Vin)
NetC56_1: C56.1 U10.1(CB)
NetC56_2: C56.2 D15.3(K) L8.1 U10.6(SW)
NetC71_2: C71.2 L8.2 L9.1 R69.2
NetD14_1: D14.1(A) R67.1
NetQ2_3: Q2.3(D) Q3.1(G) R62.1
NetR68_1: R68.1 R69.1 U10.3(FB)

Not connected (* = marked no-connect by the designer): D15 1(A1)*; U11 1(REF)*

### Notes on the sheet
- Voltage = 3.3 [V]
- (near TP35) Voltage = 3.3 [V]
- (near TP36) Voltage = 3.3 [V]
- (near U11) Keep unconnected
- Title
- Institut d'automatisation industrielle
  rte de Cheseaux 1
  CH-1401 Yverdon-les-Bains
  T +41(0)24 55 77 377    F +41(0)24 55 76 320
  http://iai.heig-vd.ch       iai@heig-vd.ch
- Date:
- Size:
- A4
- Project:
- Sheet
- of
- No.
- Author:
- SVN
- Version
- File:

### Library data of the parts
C27 C54 C57 C63 = Cap_100nF: Capacitor; Value: 100nF; Supplier 1: Digi-Key; Supplier Part Number 1: 478-1395-1-ND
C48 = Cap_2.2uF: Capacitor; Value: 2.2uF; Supplier 1: Digi-Key; Supplier Part Number 1: 490-10744-1-ND
C50 C71 = Cap_68uF: Capacitor; Value: 68uF; Supplier 1: Digi-Key; Supplier Part Number 1: 445-11687-1-ND
C51 C53 = Cap_10uF: Capacitor; Value: 10uF; Supplier 1: Digi-Key; Supplier Part Number 1: 445-7886-1-ND
C52 = Cap_1uF: Capacitor; Value: 1uF; Supplier 1: Digi-Key; Supplier Part Number 1: 490-10743-1-ND
C55 = Cap_22nF: Capacitor; Value: 22nF; Supplier 1: Digi-Key; Supplier Part Number 1: 311-1138-1-ND
C56 = Cap_470nF: Capacitor; Value: 470nF; Supplier 1: Digi-Key; Supplier Part Number 1: 399-8100-1-ND
C70 = Cap_10pF: Capacitor; Value: 10pF; Supplier 1: Digi-Key; Supplier Part Number 1: 311-1099-1-ND
D14 = LED_Green_0805: Supplier 1: Digi-Key; Supplier Part Number 1: 475-1410-1-ND
L8 = SRR1260A-820M: Value: 82uH; Supplier 1: Digi-Key; Supplier Part Number 1: SRR1260A-820MCT-ND
Q3 = FDN338P: MOSFet P; Supplier 1: Digi-Key; Supplier Part Number 1: FDN338PCT-ND; Value: FDN338P
R34 R36 R62 = Res_100k: Resistor; Value: 100k; Supplier 1: Digi-Key; Supplier Part Number 1: 311-100KCRCT-ND
R63 = Res_10k: Resistor; Value: 10k; Supplier 1: Digi-Key; Supplier Part Number 1: 311-10.0KCRCT-ND
R64 R65 = Res_0R: Resistor; Value: 0R; Supplier 1: Digi-Key; Supplier Part Number 1: 311-0.0ARCT-ND
R67 = Res_56R: Resistor; Value: 56R; Supplier 1: Digi-Key; Supplier Part Number 1: 311-56.0CRCT-ND
R68 = Res_1k: Resistor; Value: 1k; Supplier 1: Digi-Key; Supplier Part Number 1: 311-1.00KCRCT-ND
R69 = Res_3k3: Resistor; Value: 3k3; Supplier 1: Digi-Key; Supplier Part Number 1: 311-3.30KCRCT-ND
TP19 TP31 TP32 TP34-TP38 = TP: =Value; Supplier 1: Digi-Key; Supplier Part Number 1: 36-5006-ND
U4 = AD8648ARZ: Quad Channel Wide Bandwidth Operational Amplifier, 22 MHz BW, 12 V/us SR, Industrial, 14-pin SOIC (R-14), Tube; Generic Part Number: AD8648; Manufacturer: Analog Devices; Amplifiers Per Package: 4; Automotive Qualified: Yes; Input Bias Current: 200fA; Input Offset Voltage: 700uV; Iq/Amp: 2mA; Slew Rate: 12V/us; Small Signal Bandwidth: 22MHz; V Span Max: 5.5V; V Span Min: 2.7V; DatasheetVersion: Rev. D; PackageVersion: 060606-A; PackageReference: R-14; PackageDescription: 14-Pin Standard Small Outline Package, Body 8.65 x 3.9 mm, Pitch 1.27 mm; Mounting Technology: Surface Mount; Code_JEDEC: MS-012-AB; PartNumber: AD8648ARZ; ComponentLink1Description: Manufacturer URL; ComponentLink1URL: http://www.analog.com/en/index.html; ComponentLink2Description: Datasheet; ComponentLink2URL: http://www.analog.com/static/imported-files/data_sheets/AD8646_8647_8648.pdf; ComponentLink3Description: Package Specification; ComponentLink3URL: http://www.analog.com/static/imported-files/packages/PKG_PDF/SOIC_Narrow%20(R)/R_14.pdf; Supplier 1: Digi-Key; Supplier Part Number 1: AD8648ARZ-ND
U9 = TPS78233DDCR: Single Output LDO, 150 mA, Fixed 3.3 V Output, 2.2 to 5.5 V Input, with 0.5 uA Quiescent Current, 5-pin SOT (DDC), -40 to 125 degC, Green (RoHS & no Sb/Br); Manufacturer: Texas Instruments; Accuracy(%): 3; Dynamic Voltage Scaling: TRUE; Fixed Output Options(V): 3.3; Iout(Max)(A): 0.15; Iq(Typ)(mA): 0.0005; Rating: Catalog; SubFamily: Single Channel LDO; Vdo(Typ)(mV): 130; Vin(Max)(V): 5.5; Vin(Min)(V): 2.2; DatasheetVersion: SBVS115B; PackageVersion: 4204403-2/E; PackageReference: DDC5; PackageDescription: 5-Pin Plastic Small Outline, Body 2.9 x 1.6 mm, 0.95 mm Pitch; Supplier 1: Digi-Key; Supplier Part Number 1: 296-24059-1-ND; Eco-Plan: Green (RoHS & no Sb/Br); Vout Adj(Max)(V): 3.3; Vout Adj(Min)(V): 3.3; Mounting Technology: Surface Mount; Code_JEDEC: MO-193; PartNumber: TPS78233DDCR; ComponentLink1Description: Manufacturer URL; ComponentLink1URL: http://www.ti.com/; ComponentLink2Description: Datasheet; ComponentLink2URL: http://www.ti.com/general/docs/lit/getliterature.tsp?genericPartNumber=TPS78233&fileType=pdf; ComponentLink3Description: Package Specification; ComponentLink3URL: http://www.ti.com/litv/pdf/mpds123d
U10 = LM2842YMK-ADJL/NOPB: 600 mA up to 42V Input Step-Down DC/DC Regulator, Thin 6-pin SOT23, Pb-Free, 1000 Reel; Supplier 1: Digi-Key; Supplier Part Number 1: LM2842YMK-ADJL/NOPBCT-ND
D15 = BAT54C: Supplier 1: Digi-Key; Supplier Part Number 1: BAT54CLT1GOSCT-ND
L5-L7 L9 = Bead: Value: Bead; Supplier 1: Digi-Key; Supplier Part Number 1: 240-2399-1-ND
Q2 = FDV301N: Value: FDV301N; Supplier 1: Digi-Key; Supplier Part Number 1: FDV301NCT-ND
U11 = LM4120IM5-3.3: Supplier 1: Digi-Key; Supplier Part Number 1: LM4120IM5-3.3/NOPBCT-ND

## Sheet PositionMeasurement.SchDoc: MSE - CSYEI : Position measurement
size A4; Author: BKO + PKI; SheetNumber: 6; SheetTotal: 8; SVN: OUI; Version: 2.1; NoProject: <no>; TitleProject: <project>
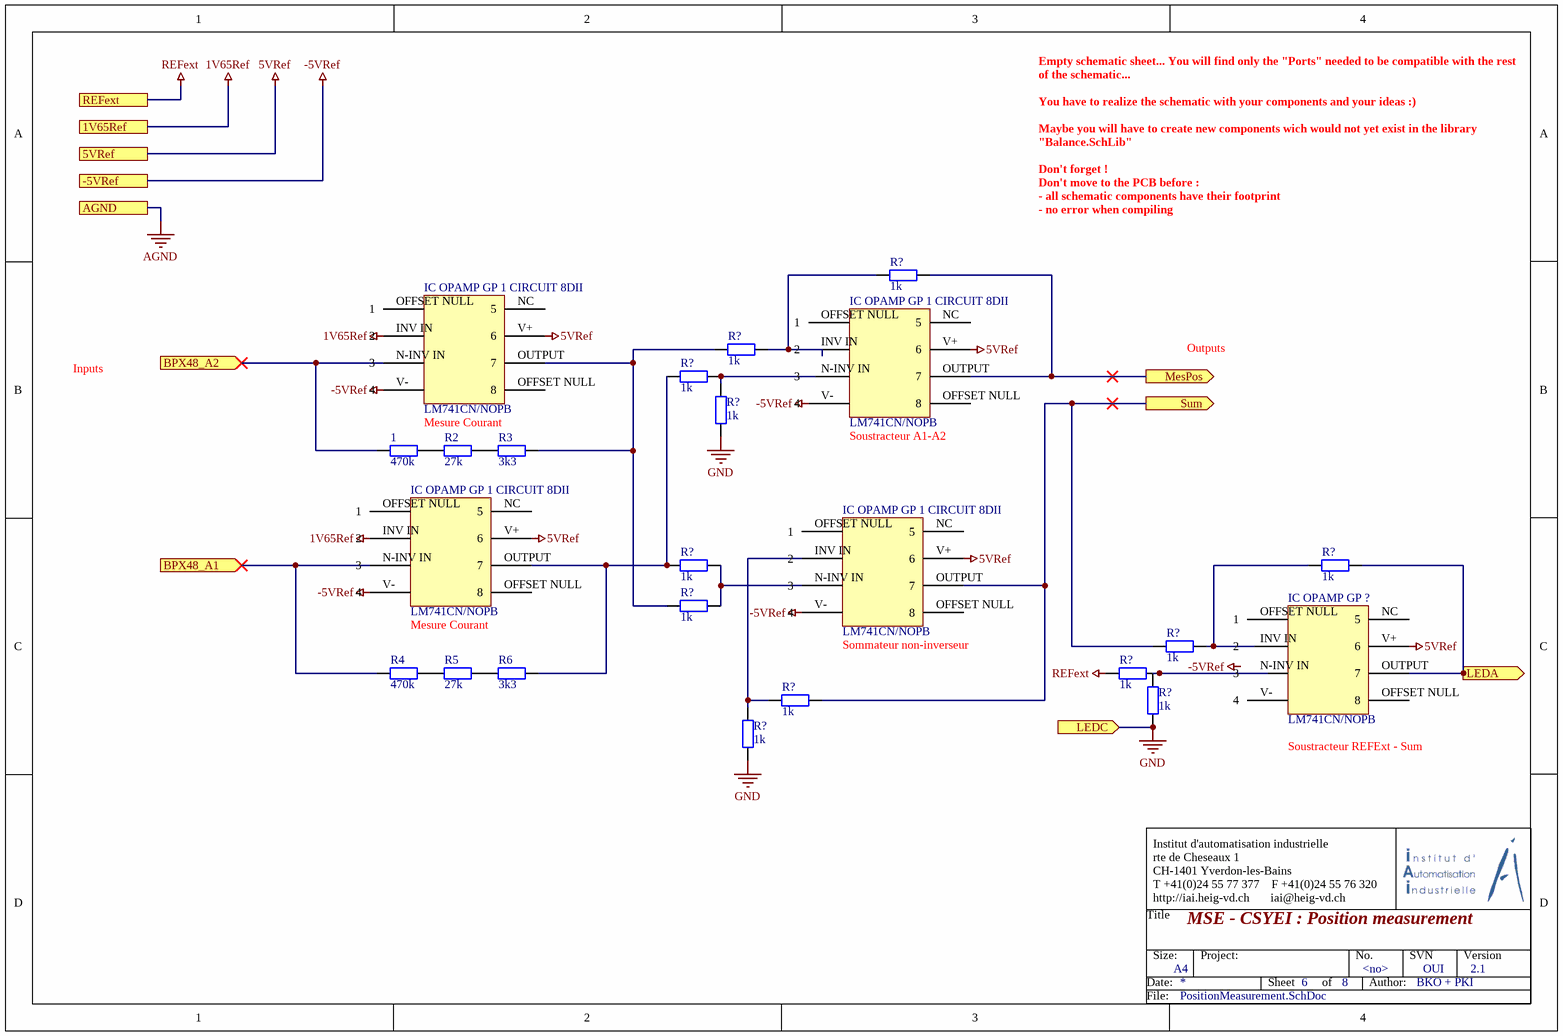
[diagram p5: PositionMeasurement.SchDoc]

### Parts
(Parts that share a designator on the sheet are numbered #1, #2 ... from top to bottom, then left to right.)
1  470k  [RESC2012N]
IC_OPAMP_GP_1_CIRCUIT_8DII#1  LM741CN/NOPB
IC_OPAMP_GP_1_CIRCUIT_8DII#2  LM741CN/NOPB
IC_OPAMP_GP_1_CIRCUIT_8DII#3  LM741CN/NOPB
IC_OPAMP_GP_1_CIRCUIT_8DII#4  LM741CN/NOPB
IC_OPAMP_GP_?  LM741CN/NOPB
R2  27k  [RESC2012N]
R3#1  3k3  [RESC2012N]
R4#1  470k  [RESC2012N]
R5#1  27k  [RESC2012N]
R6  3k3  [RESC2012N]
R?#1  1k  [RESC2012N]
R?#2  1k  [RESC2012N]
R?#3  1k  [RESC2012N]
R?#4  1k  [RESC2012N]
R?#5  1k  [RESC2012N]
R?#6  1k  [RESC2012N]
R?#7  1k  [RESC2012N]
R?#8  1k  [RESC2012N]
R?#9  1k  [RESC2012N]
R?#10  1k  [RESC2012N]
R?#11  1k  [RESC2012N]
R?#12  1k  [RESC2012N]

### Ports
1V65Ref, 5VRef, -5VRef, AGND, BPX48_A1 (in), BPX48_A2 (in), LEDA (out), LEDC (in), MesPos (out), REFext, Sum (out)

### Nets
5VRef: IC_OPAMP_GP_1_CIRCUIT_8DII#1.V+(6) IC_OPAMP_GP_1_CIRCUIT_8DII#2.V+(6) IC_OPAMP_GP_1_CIRCUIT_8DII#3.V+(6) IC_OPAMP_GP_1_CIRCUIT_8DII#4.V+(6) IC_OPAMP_GP_?.V+(6) ; port 5VRef
-5VRef: port -5VRef
GND: R?#4.1 R?#11.1 R?#12.1 ; port LEDC
REFext: R?#9.1 ; port REFext
Net1_1: 1.1 ; port BPX48_A2
Net1_2: 1.2 R2.1
NetC67_2: R4#1.1 ; port BPX48_A1
NetC68_1: IC_OPAMP_GP_?.OUTPUT(7) R?#5.2 ; port LEDA
NetIC_OPAMP_GP_1_CIRCUIT_8DII#1_OUTPUT: IC_OPAMP_GP_1_CIRCUIT_8DII#1.OUTPUT(7) R3#1.2 R?#2.1 R?#7.2
NetIC_OPAMP_GP_1_CIRCUIT_8DII#2_OUTPUT: IC_OPAMP_GP_1_CIRCUIT_8DII#2.OUTPUT(7) R?#1.2 ; port MesPos
NetIC_OPAMP_GP_1_CIRCUIT_8DII#3_OUTPUT: IC_OPAMP_GP_1_CIRCUIT_8DII#3.OUTPUT(7) R6.2 R?#3.1 R?#6.2
NetIC_OPAMP_GP_1_CIRCUIT_8DII#4_OUTPUT: IC_OPAMP_GP_1_CIRCUIT_8DII#4.OUTPUT(7) R?#8.1 R?#10.1 ; port Sum
NetR2_2: R2.2 R3#1.1
NetR4#1_2: R4#1.2 R5#1.1
NetR5#1_2: R5#1.2 R6.1
NetR?#1_1: R?#1.1 R?#2.2
NetR?#3_2: R?#3.2 R?#4.2
NetR?#5_1: R?#5.1 R?#8.2
NetR?#6_1: R?#6.1 R?#7.1
NetR?#9_2: R?#9.2 R?#11.2
NetR?#10_2: R?#10.2 R?#12.2

Not connected (* = marked no-connect by the designer): IC_OPAMP_GP_1_CIRCUIT_8DII#1 INV IN(2) N-INV IN(3) NC(5) OFFSET NULL(1) V-(4); IC_OPAMP_GP_1_CIRCUIT_8DII#2 INV IN(2) N-INV IN(3) NC(5) OFFSET NULL(1) V-(4); IC_OPAMP_GP_1_CIRCUIT_8DII#3 INV IN(2) N-INV IN(3) NC(5) OFFSET NULL(1) V-(4); IC_OPAMP_GP_1_CIRCUIT_8DII#4 INV IN(2) N-INV IN(3) NC(5) OFFSET NULL(1) V-(4); IC_OPAMP_GP_? INV IN(2) N-INV IN(3) NC(5) OFFSET NULL(1) V-(4)

### Notes on the sheet
- Empty schematic sheet... You will find only the "Ports" needed to be compatible with the rest of the schematic...
  You have to realize the schematic with your components and your ideas :)
  Maybe you will have to create new components wich would not yet exist in the library "Balance.SchLib"
  Don't forget !
  Don't move to the PCB before :
  - all schematic components have their footprint
  - no error when compiling
- Inputs
- Outputs
- Mesure Courant
- (near IC_OPAMP_GP_1_CIRCUIT_8DII#2) Soustracteur A1-A2
- (near IC_OPAMP_GP_1_CIRCUIT_8DII#4) Sommateur non-inverseur
- (near IC_OPAMP_GP_?) Soustracteur REFExt - Sum
- Labels drawn without touching a wire or pin: 1V65Ref, -5VRef
- Title
- Institut d'automatisation industrielle
  rte de Cheseaux 1
  CH-1401 Yverdon-les-Bains
  T +41(0)24 55 77 377    F +41(0)24 55 76 320
  http://iai.heig-vd.ch       iai@heig-vd.ch
- Date:
- Size:
- A4
- Project:
- Sheet
- of
- No.
- Author:
- SVN
- Version
- File:

### Library data of the parts
1 R4#1 = Res_470k: Resistor; Value: 470k; Supplier 1: Digi-Key; Supplier Part Number 1: 311-470KCRCT-ND
IC_OPAMP_GP_1_CIRCUIT_8DII#1-IC_OPAMP_GP_1_CIRCUIT_8DII#4 IC_OPAMP_GP_? = LM741CN/NOPB: IC OPAMP GP 1 CIRCUIT 8DII; Supplier 1: Digi-Key; Supplier Part Number 1: LM741CNNS/NOPB-ND
R2 R5#1 = Res_27k: Resistor; Value: 27k; Supplier 1: Digi-Key; Supplier Part Number 1: 311-27.0KCRCT-ND
R3#1 R6 = Res_3k3: Resistor; Value: 3k3; Supplier 1: Digi-Key; Supplier Part Number 1: 311-3.30KCRCT-ND
R?#1-R?#12 = Res_1k: Resistor; Value: 1k; Supplier 1: Digi-Key; Supplier Part Number 1: 311-1.00KCRCT-ND

## Sheet CurrentVoltageMeasurement.SchDoc: MSE - CSYEI : Power stage
size A3; Author: Guillaume Volery; SheetNumber: 7; SheetTotal: 8; SVN: OUI; Version: 2.1; NoProject: <no>; TitleProject: <project>
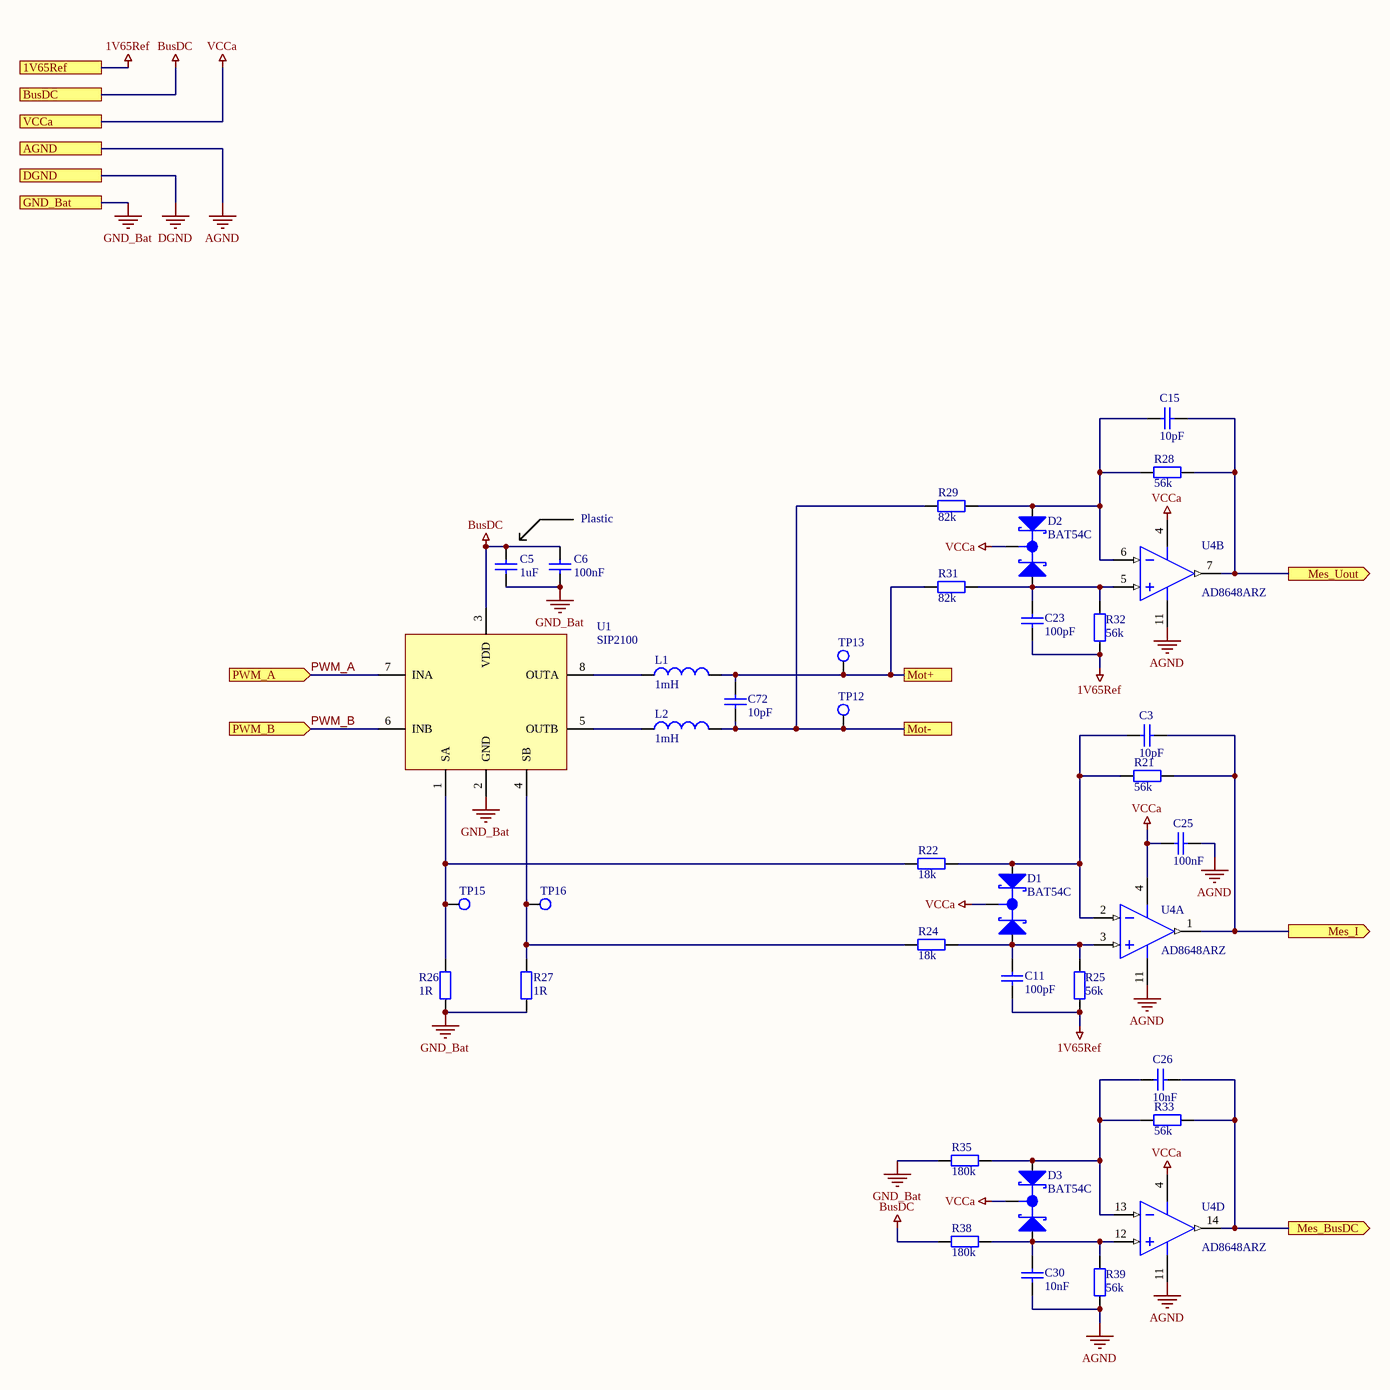
[diagram p6: CurrentVoltageMeasurement.SchDoc]

### Parts
C3  10pF  [CAPC2012N]
C5  1uF  [CAP2824]
C6  100nF  [CAPC2012N]
C11  100pF  [CAPC2012N]
C15  10pF  [CAPC2012N]
C23  100pF  [CAPC2012N]
C25  100nF  [CAPC2012N]
C26  10nF  [CAPC2012N]
C30  10nF  [CAPC2012N]
C72  10pF  [CAPC2012N]
D1  BAT54C  [SOT23-3N]
D2  BAT54C  [SOT23-3N]
D3  BAT54C  [SOT23-3N]
L1  1mH  [B82477G4]
L2  1mH  [B82477G4]
R21  56k  [RESC2012N]
R22  18k  [RESC2012N]
R24  18k  [RESC2012N]
R25  56k  [RESC2012N]
R26  1R  [RESC2012N]
R27  1R  [RESC2012N]
R28  56k  [RESC2012N]
R29  82k  [RESC2012N]
R31  82k  [RESC2012N]
R32  56k  [RESC2012N]
R33  56k  [RESC2012N]
R35  180k  [RESC2012N]
R38  180k  [RESC2012N]
R39  56k  [RESC2012N]
TP12  TP  [Testpoint]  (value not drawn)
TP13  TP  [Testpoint]  (value not drawn)
TP15  TP  [Testpoint]  (value not drawn)
TP16  TP  [Testpoint]  (value not drawn)
U1  SIP2100  [SOIC8]
U4  AD8648ARZ  [ADI-R-14_M]  (parts A,B,D of 4)

### Ports
1V65Ref, AGND, BusDC, DGND, GND_Bat, Mes_BusDC (out), Mes_I (out), Mes_Uout (out), Mot+, Mot-, PWM_A (in), PWM_B (in), VCCa

### Nets
1V65Ref: C11.1 C23.1 R25.1 R32.1 ; port 1V65Ref
AGND: C25.2 C30.1 R39.1 U4.11(-V) ; port AGND
BusDC: C5.2 C6.2 R38.2 U1.3(VDD) ; port BusDC
GND_Bat: C5.1 C6.1 R26.1 R27.1 R35.2 U1.2(GND) ; port GND_Bat
VCCa: C25.1 D1.3(K) D2.3(K) D3.3(K) U4.4(+V) ; port VCCa
PWM_A: U1.7(INA) ; port PWM_A
PWM_B: C3.1 R21.1 U1.6(INB) U4.1(OUT_A) ; port Mes_I, port PWM_B
NetC3_2: C3.2 D1.1(A1) R21.2 R22.1 U4.2(-IN_A)
NetC11_2: C11.2 D1.2(A2) R24.1 R25.2 U4.3(+IN_A)
NetC15_1: C15.1 C26.2 R28.1 R33.1 U4.7(OUT_B) U4.14(OUT_D) ; port Mes_Uout, port Mes_BusDC
NetC15_2: C15.2 D2.1(A1) R28.2 R29.1 U4.6(-IN_B)
NetC23_2: C23.2 D2.2(A2) R31.1 R32.2 U4.5(+IN_B)
NetC26_1: C26.1 D3.1(A1) R33.2 R35.1 U4.13(-IN_D)
NetC30_2: C30.2 D3.2(A2) R38.1 R39.2 U4.12(+IN_D)
NetC65_2: C72.2 L1.2 R31.2 TP13.1 ; port Mot+
NetC72_1: C72.1 L2.2 R29.2 TP12.1 ; port Mot-
NetL1_1: L1.1 U1.8(OUTA)
NetL2_1: L2.1 U1.5(OUTB)
NetR22_2: R22.2 R26.2 TP15.1 U1.1(SA)
NetR24_2: R24.2 R27.2 TP16.1 U1.4(SB)

### Notes on the sheet
- (near C6) Plastic
- Title
- Institut d'automatisation industrielle
  rte de Cheseaux 1
  CH-1401 Yverdon-les-Bains
  T +41(0)24 55 77 377    F +41(0)24 55 76 320
  http://iai.heig-vd.ch       iai@heig-vd.ch
- Date:
- Size:
- A3
- Project:
- Sheet
- of
- No.
- Author:
- SVN
- Version
- File:

### Library data of the parts
C3 C15 C72 = Cap_10pF: Capacitor; Value: 10pF; Supplier 1: Digi-Key; Supplier Part Number 1: 311-1099-1-ND
C5 = Cap_1uF_Plastic: Capacitor; Value: 1uF; Supplier 1: Digi-Key; Supplier Part Number 1: 399-6416-1-ND
C6 C25 = Cap_100nF: Capacitor; Value: 100nF; Supplier 1: Digi-Key; Supplier Part Number 1: 478-1395-1-ND
C11 C23 = Cap_100pF: Capacitor; Value: 100pF; Supplier 1: Digi-Key; Supplier Part Number 1: 399-1122-1-ND
C26 C30 = Cap_10nF: Capacitor; Value: 10nF; Supplier 1: Digi-Key; Supplier Part Number 1: 311-1136-1-ND
L1 L2 = B82477G4105M: Supplier 1: Digi-Key; Supplier Part Number 1: 495-1820-1-ND; Value: 1mH
R21 R25 R28 R32 R33 R39 = Res_56k: Resistor; Value: 56k; Supplier 1: Digi-Key; Supplier Part Number 1: 311-56.0KCRCT-ND
R22 R24 = Res_18k: Resistor; Value: 18k; Supplier 1: Digi-Key; Supplier Part Number 1: 311-18.0KCRCT-ND
R26 R27 = Res_1R: Resistor; Value: 1R; Supplier 1: Digi-Key; Supplier Part Number 1: CRT0805-CY-1R00ELFCT-ND
R29 R31 = Res_82k: Resistor; Value: 82k; Supplier 1: Digi-Key; Supplier Part Number 1: 311-82.0KCRCT-ND
R35 R38 = Res_180k: Resistor; Value: 180k; Supplier 1: Digi-Key; Supplier Part Number 1: 311-180KCRCT-ND
TP12 TP13 TP15 TP16 = TP: =Value; Supplier 1: Digi-Key; Supplier Part Number 1: 36-5006-ND
U4 = AD8648ARZ: as U4 on sheet PowerSupply; DatasheetVersion: Rev. D; PackageVersion: 060606-A; PackageReference: R-14; PackageDescription: 14-Pin Standard Small Outline Package, Body 8.65 x 3.9 mm, Pitch 1.27 mm; Mounting Technology: Surface Mount; Code_JEDEC: MS-012-AB; PartNumber: AD8648ARZ; ComponentLink1Description: Manufacturer URL; ComponentLink1URL: http://www.analog.com/en/index.html; ComponentLink2Description: Datasheet; ComponentLink2URL: http://www.analog.com/static/imported-files/data_sheets/AD8646_8647_8648.pdf; ComponentLink3Description: Package Specification; ComponentLink3URL: http://www.analog.com/static/imported-files/packages/PKG_PDF/SOIC_Narrow%20(R)/R_14.pdf; Supplier 1: Digi-Key; Supplier Part Number 1: AD8648ARZ-ND
D1-D3 = BAT54C: Supplier 1: Digi-Key; Supplier Part Number 1: BAT54CLT1GOSCT-ND
U1 = SIP2100: Supplier 1: Digi-Key; Supplier Part Number 1: SIP2100DY-T1-GE3CT-ND

## Sheet CapacitiveTouch.SchDoc: MSE - CSYEI : TouchPad buttons
size A4; Author: Guillaume Volery; SheetNumber: 8; SheetTotal: 8; SVN: OUI; Version: 2.1; NoProject: <no>; TitleProject: <project>
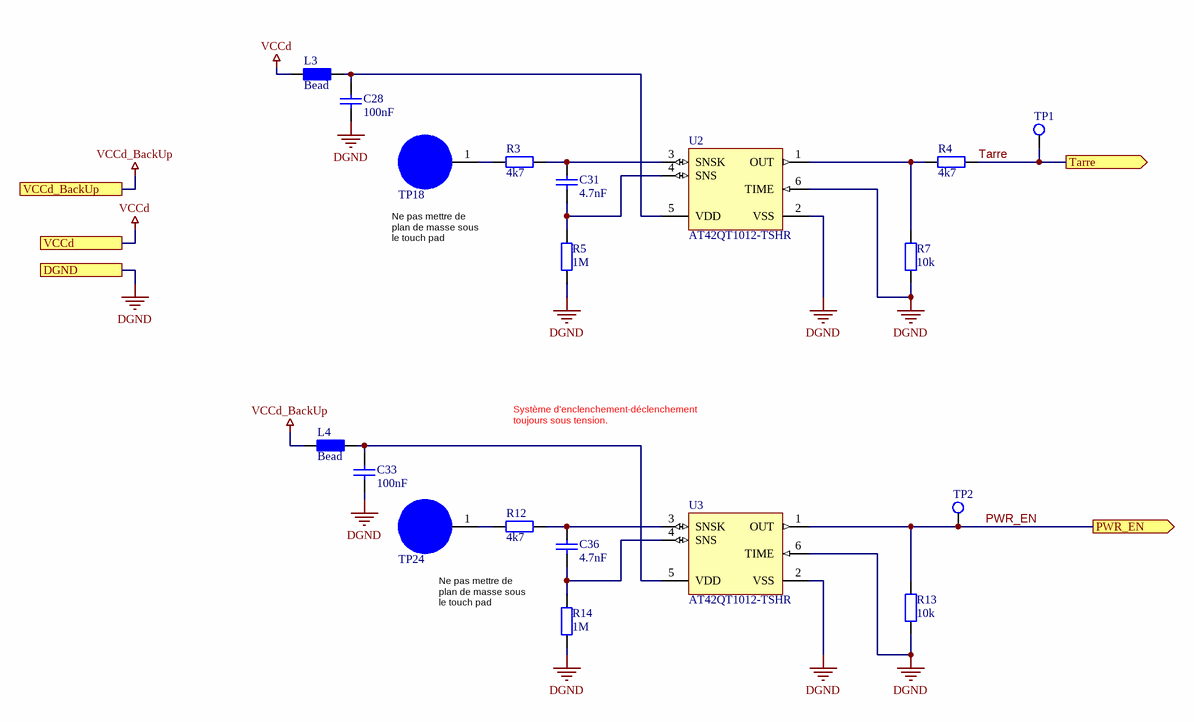
[diagram p7: CapacitiveTouch.SchDoc]

### Parts
(Parts that share a designator on the sheet are numbered #1, #2 ... from top to bottom, then left to right.)
C28  100nF  [CAPC2012N]
C31  4.7nF  [CAPC2012N]
C33  100nF  [CAPC2012N]
C36  4.7nF  [CAPC2012N]
L3  Bead  [RESC2012N]
L4  Bead  [RESC2012N]
R3#2  4k7  [RESC2012N]
R4#2  4k7  [RESC2012N]
R5#2  1M  [RESC2012N]
R7  10k  [RESC2012N]
R12  4k7  [RESC2012N]
R13  10k  [RESC2012N]
R14  1M  [RESC2012N]
TP1  TP  [Testpoint]  (value not drawn)
TP2  TP  [Testpoint]  (value not drawn)
TP18  TouchPad10mm  [TouchPad10mm]  (value not drawn)
TP24  TouchPad10mm  [TouchPad10mm]  (value not drawn)
U2  AT42QT1012-TSHR  [SOT-23-6]
U3  AT42QT1012-TSHR  [SOT-23-6]

### Ports
DGND, PWR_EN (out), Tarre (out), VCCd, VCCd_BackUp

### Nets
DGND: C28.1 C33.1 R5#2.1 R7.1 R13.1 R14.1 U2.2(VSS) U2.6(TIME) U3.2(VSS) U3.6(TIME) ; port DGND
VCCd: L3.1 ; port VCCd
VCCd_BackUp: L4.1 ; port VCCd_BackUp
PWR_EN: R13.2 TP2.1 U3.1(OUT) ; port PWR_EN
Tarre: R4#2.2 TP1.1 ; port Tarre
NetC28_2: C28.2 L3.2 U2.5(VDD)
NetC31_1: C31.1 R5#2.2 U2.4(SNS)
NetC31_2: C31.2 R3#2.2 U2.3(SNSK)
NetC33_2: C33.2 L4.2 U3.5(VDD)
NetC36_1: C36.1 R14.2 U3.4(SNS)
NetC36_2: C36.2 R12.2 U3.3(SNSK)
NetR3#2_1: R3#2.1 TP18.1
NetR4#2_1: R4#2.1 R7.2 U2.1(OUT)
NetR12_1: R12.1 TP24.1

### Notes on the sheet
- Ne pas mettre de
  plan de masse sous
  le touch pad
- Système d'enclenchement-déclenchement
  toujours sous tension.
- Title
- Institut d'automatisation industrielle
  rte de Cheseaux 1
  CH-1401 Yverdon-les-Bains
  T +41(0)24 55 77 377    F +41(0)24 55 76 320
  http://iai.heig-vd.ch       iai@heig-vd.ch
- Date:
- Size:
- A4
- Project:
- Sheet
- of
- No.
- Author:
- SVN
- Version
- File:

### Library data of the parts
C28 C33 = Cap_100nF: Capacitor; Value: 100nF; Supplier 1: Digi-Key; Supplier Part Number 1: 478-1395-1-ND
C31 C36 = Cap_4.7nF: Capacitor; Value: 4.7nF; Supplier 1: Digi-Key; Supplier Part Number 1: 311-1431-1-ND
R3#2 R4#2 R12 = Res_4k7: Resistor; Value: 4k7; Supplier 1: Digi-Key; Supplier Part Number 1: 311-4.70KCRCT-ND
R5#2 R14 = Res_1M: Resistor; Value: 1M; Supplier 1: Digi-Key; Supplier Part Number 1: 311-1.00MCRCT-ND
R7 R13 = Res_10k: Resistor; Value: 10k; Supplier 1: Digi-Key; Supplier Part Number 1: 311-10.0KCRCT-ND
TP1 TP2 = TP: =Value; Supplier 1: Digi-Key; Supplier Part Number 1: 36-5006-ND
U2 U3 = AT42QT1012-TSHR: One-channel Toggle-mode Touch Sensor IC with Power Management Functions, -40° to +85° C, 6-pin SOT23; DatasheetVersion: revD, Aug-2010; PackageVersion: revA, Jun-2008; PackageReference: 6ST1; PackageDescription: 6-Lead, 2.90 x 1.60 mm Plastic Small Outline Package (SOT23); Code_JEDEC: MO-178-AB; Code_IPC: SOT26A-6; ComponentLink1Description: Manufacturer URL; ComponentLink1URL: http://www.atmel.com/; ComponentLink2Description: Datasheet; ComponentLink2URL: http://www.atmel.com/Images/doc9543.pdf; Supplier 1: Digi-Key; Supplier Part Number 1: AT42QT1012-TSHRCT-ND
L3 L4 = Bead: Value: Bead; Supplier 1: Digi-Key; Supplier Part Number 1: 240-2399-1-ND

## Nets that join several sheets
1V65Ref: Controller (R17.1), PowerSupply (TP19.1 U4.8 U4.9), CurrentVoltageMeasurement (C11.1 C23.1 R25.1 R32.1)
3V3Ref: Controller (C9.2 U8.16), PowerSupply (C55.2 R34.2 TP36.1 U11.5)
AGND: Controller (10 pins), PowerSupply (9 pins), CurrentVoltageMeasurement (C25.2 C30.1 R39.1 U4.11)
BusDC: PowerSupply (C50.2 Q3.3 TP31.1), CurrentVoltageMeasurement (C5.2 C6.2 R38.2 U1.3)
DGND: TopLevel (C12.1 X7.5), Controller (16 pins), Display (11 pins), PowerSupply (15 pins), CapacitiveTouch (10 pins)
GND: TopLevel (C69.2 D13.3 X4.2), PositionMeasurement (R?#4.1 R?#11.1 R?#12.1)
GND_Bat: TopLevel (18 pins), PowerSupply (5 pins), CurrentVoltageMeasurement (6 pins)
REFext: TopLevel (X3.2), Controller (R52.2), PositionMeasurement (R?#9.1)
Vbat: TopLevel (8 pins), PowerSupply (8 pins)
VCCa: Controller (C42.2 U8.19), PowerSupply (C63.2 L5.2 TP35.1 U4.4), CurrentVoltageMeasurement (5 pins)
VCCd: Controller (14 pins), Display (5 pins), PowerSupply (5 pins), CapacitiveTouch (L3.1)
VCCd_BackUp: PowerSupply (C52.2 TP32.1 U9.5), CapacitiveTouch (L4.1)
VUSB: TopLevel (L10.2 U12.5), Controller (R20.2 U8.34)
D_N: TopLevel (U12.3 X7.2), Controller (U8.36)
D_P: TopLevel (U12.4 X7.3), Controller (U8.37)
ID: TopLevel (X7.4), Controller (U8.33)
LCD_A0: Controller (TP11.1 U8.8), Display (U6.38)
LCD_RS: Controller (TP7.1 U8.32), Display (U6.39)
LCD_SS: Controller (TP6.1 U8.31), Display (U6.40)
LedLcd: Controller (U8.60), Display (Q1.1 R42.2 TP21.1)
MOSI: Controller (TP10.1 U8.6), Display (U6.36)
Net1_1: TopLevel (C66.1 D10.3 X3.1), PositionMeasurement (1.1)
NetC15_1: Controller (R30.2 R37.2), CurrentVoltageMeasurement (6 pins)
NetC65_2: TopLevel (C65.2 L11.2), CurrentVoltageMeasurement (C72.2 L1.2 R31.2 TP13.1)
NetC67_2: TopLevel (C67.2 D11.3 X3.4), PositionMeasurement (R4#1.1)
NetC68_1: TopLevel (C68.1 D12.3 X4.4), PositionMeasurement (IC_OPAMP_GP_?.OUTPUT R?#5.2)
NetC72_1: TopLevel (C73.2 L11.1), CurrentVoltageMeasurement (C72.1 L2.2 R29.2 TP12.1)
NetIC_OPAMP_GP_1_CIRCUIT_8DII#2_OUTPUT: Controller (R51.2), PositionMeasurement (IC_OPAMP_GP_1_CIRCUIT_8DII#2.OUTPUT R?#1.2)
NetIC_OPAMP_GP_1_CIRCUIT_8DII#4_OUTPUT: Controller (R53.2), PositionMeasurement (IC_OPAMP_GP_1_CIRCUIT_8DII#4.OUTPUT R?#8.1 R?#10.1)
PWM_A: Controller (TP5.1 U8.63), CurrentVoltageMeasurement (U1.7)
PWM_B: Controller (R23.2 TP4.1 U8.62), CurrentVoltageMeasurement (C3.1 R21.1 U1.6 U4.1)
PWR_EN: PowerSupply (Q2.1 R63.2 U10.4 U11.3), CapacitiveTouch (R13.2 TP2.1 U3.1)
SCK: Controller (TP8.1 U8.4), Display (U6.37)
Tarre: Controller (U8.1), CapacitiveTouch (R4#2.2 TP1.1)

## Assembly variants
BALANCE_V2_1: all parts fitted